# EAGLE design breakout (EAGLE 7.1.0)

## Sheet 1 of 2
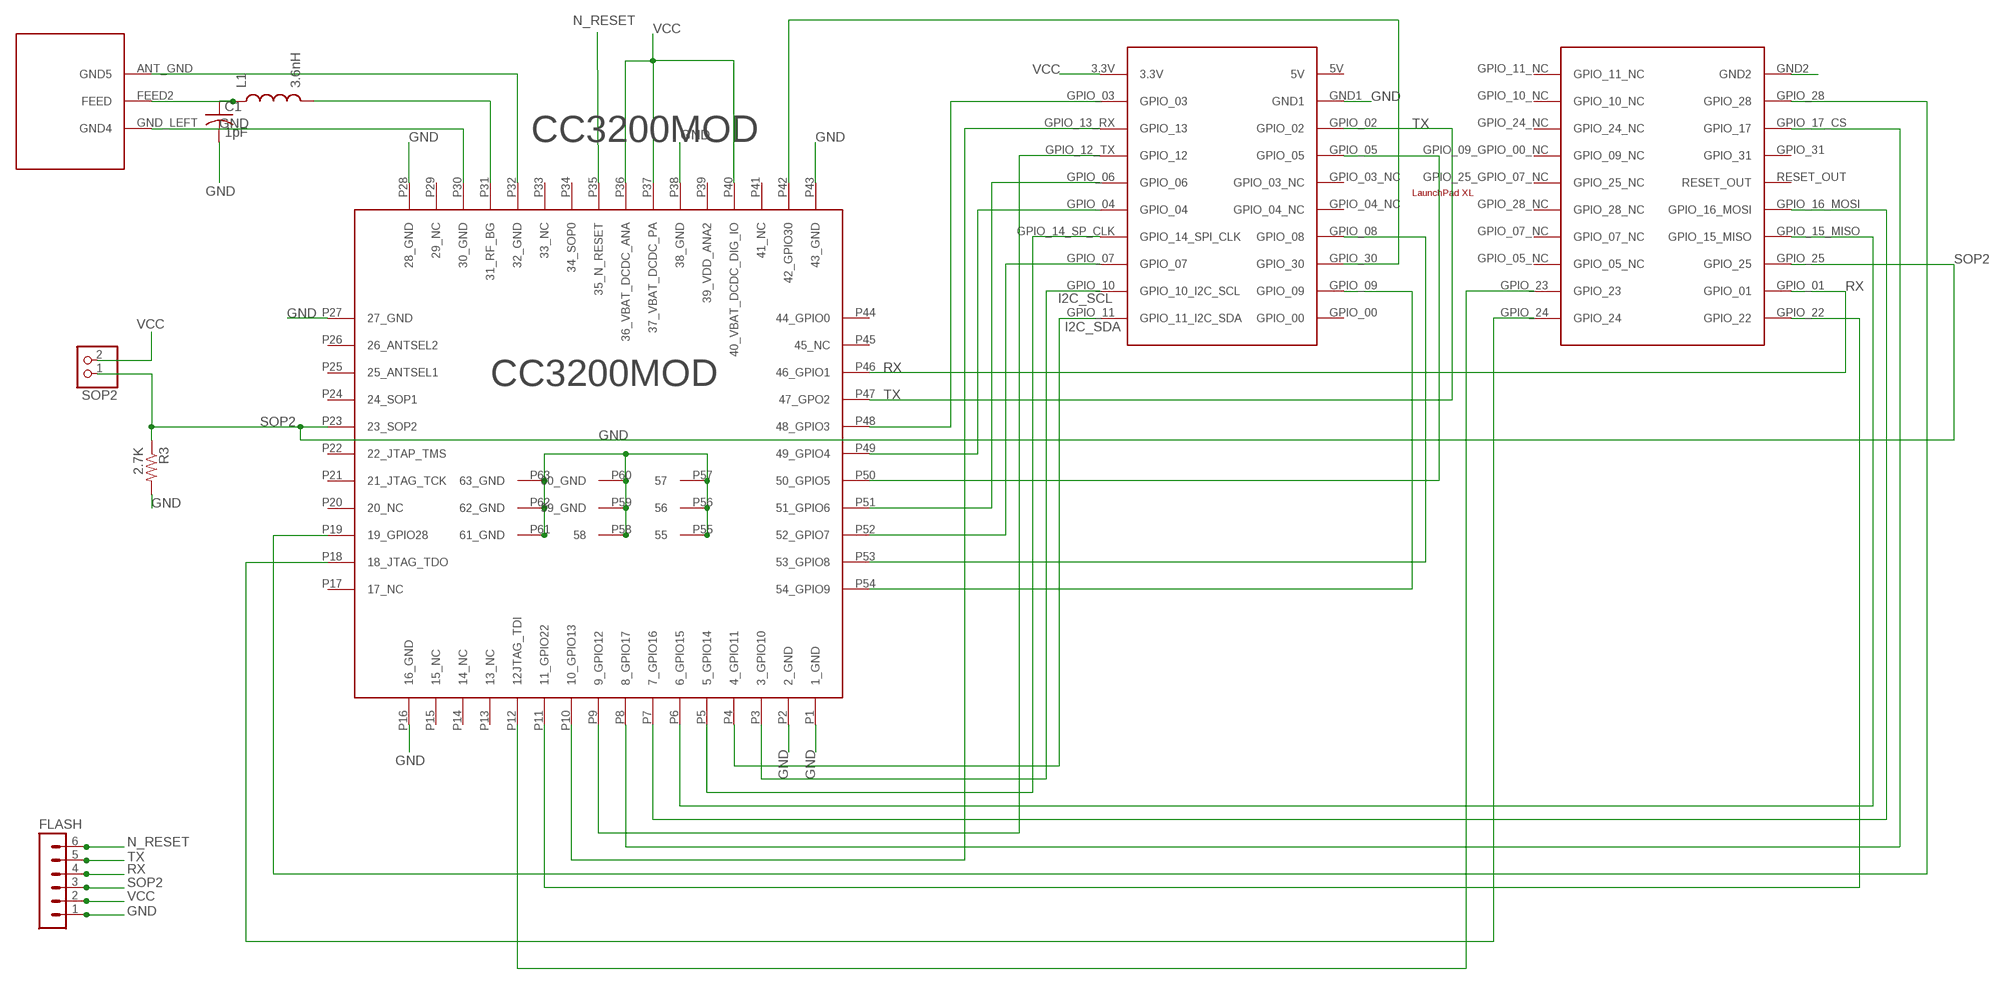
[diagram p0: schematic, sheet 1]

### Parts
ANT_PAD  ANT  [ANT]
C1  1pF  C-USC0402  [C0402]
CC3200MOD  CC3200  [CC3200MOD]
FLASH  MA06-1  [MA06-1]
L1  3.6nH  INDUCTOR-SPARKFUN0402  [C0402]
R3  2.7K  RESISTOR0603  [0603-RES]
SOP2  PINHD-1X2  [1X02]
U11  XL  [LAUNCHPADXL]

### Nets
GND: ANT_PAD.ANT_GND(GND5) ANT_PAD.GND_LEFT(GND4) C1.2 CC3200MOD.P1(1_GND) CC3200MOD.P2(2_GND) CC3200MOD.P16(16_GND) CC3200MOD.P27(27_GND) CC3200MOD.P28(28_GND) CC3200MOD.P30(30_GND) CC3200MOD.P32(32_GND) CC3200MOD.P38(38_GND) CC3200MOD.P43(43_GND) CC3200MOD.P55 CC3200MOD.P56 CC3200MOD.P57 CC3200MOD.P58 CC3200MOD.P59(59_GND) CC3200MOD.P60(60_GND) CC3200MOD.P61(61_GND) CC3200MOD.P62(62_GND) CC3200MOD.P63(63_GND) FLASH.1 R3.2 U11.GND1 U11.GND2 ; also sheet 2
GPIO_05: CC3200MOD.P50(50_GPIO5) U11.GPIO_05
GPIO_09: CC3200MOD.P54(54_GPIO9) U11.GPIO_09 ; also sheet 2
GPIO_22: CC3200MOD.P11(11_GPIO22) U11.GPIO_22
I2C_SCL: CC3200MOD.P3(3_GPIO10) U11.GPIO_10(GPIO_10_I2C_SCL) ; also sheet 2
I2C_SDA: CC3200MOD.P4(4_GPIO11) U11.GPIO_11(GPIO_11_I2C_SDA) ; also sheet 2
JTAG_TDI: CC3200MOD.P12(12JTAG_TDI) U11.GPIO_23
JTAG_TDO: CC3200MOD.P18(18_JTAG_TDO) U11.GPIO_24
N$2: ANT_PAD.FEED2(FEED) C1.1 L1.1
N$3: CC3200MOD.P31(31_RF_BG) L1.2
N$8: CC3200MOD.P6(6_GPIO15) U11.GPIO_15_MISO
N$10: CC3200MOD.P7(7_GPIO16) U11.GPIO_16_MOSI
N$11: CC3200MOD.P8(8_GPIO17) U11.GPIO_17_CS(GPIO_17)
N$12: CC3200MOD.P5(5_GPIO14) U11.GPIO_14_SP_CLK(GPIO_14_SPI_CLK)
N$13: CC3200MOD.P19(19_GPIO28) U11.GPIO_28
N$14: CC3200MOD.P42(42_GPIO30) U11.GPIO_30
N$18: CC3200MOD.P51(51_GPIO6) U11.GPIO_06
N$19: CC3200MOD.P49(49_GPIO4) U11.GPIO_04
N$21: CC3200MOD.P52(52_GPIO7) U11.GPIO_07
N$22: CC3200MOD.P53(53_GPIO8) U11.GPIO_08
N$24: CC3200MOD.P10(10_GPIO13) U11.GPIO_13_RX(GPIO_13)
N$25: CC3200MOD.P9(9_GPIO12) U11.GPIO_12_TX(GPIO_12)
N$27: CC3200MOD.P48(48_GPIO3) U11.GPIO_03
N_RESET: CC3200MOD.P35(35_N_RESET) FLASH.6
RX: CC3200MOD.P46(46_GPIO1) FLASH.4 U11.GPIO_01
SOP2: CC3200MOD.P23(23_SOP2) FLASH.3 R3.1 SOP2.1 U11.GPIO_25
TX: CC3200MOD.P47(47_GPO2) FLASH.5 U11.GPIO_02
VCC: CC3200MOD.P36(36_VBAT_DCDC_ANA) CC3200MOD.P37(37_VBAT_DCDC_PA) CC3200MOD.P40(40_VBAT_DCDC_DIG_IO) FLASH.2 SOP2.2 U11.3.3V ; also sheet 2
Unconnected: CC3200MOD.P13(13_NC) CC3200MOD.P14(14_NC) CC3200MOD.P15(15_NC) CC3200MOD.P17(17_NC) CC3200MOD.P20(20_NC) CC3200MOD.P21(21_JTAG_TCK) CC3200MOD.P22(22_JTAP_TMS) CC3200MOD.P24(24_SOP1) CC3200MOD.P25(25_ANTSEL1) CC3200MOD.P26(26_ANTSEL2) CC3200MOD.P29(29_NC) CC3200MOD.P33(33_NC) CC3200MOD.P34(34_SOP0) CC3200MOD.P39(39_VDD_ANA2) CC3200MOD.P41(41_NC) CC3200MOD.P44(44_GPIO0) CC3200MOD.P45(45_NC) U11.5V U11.GPIO_00 U11.GPIO_03_NC U11.GPIO_04_NC U11.GPIO_05_NC U11.GPIO_07_NC U11.GPIO_09_GPIO_00_NC(GPIO_09_NC) U11.GPIO_10_NC U11.GPIO_11_NC U11.GPIO_24_NC U11.GPIO_25_GPIO_07_NC(GPIO_25_NC) U11.GPIO_28_NC U11.GPIO_31 U11.RESET_OUT

## Sheet 2 of 2
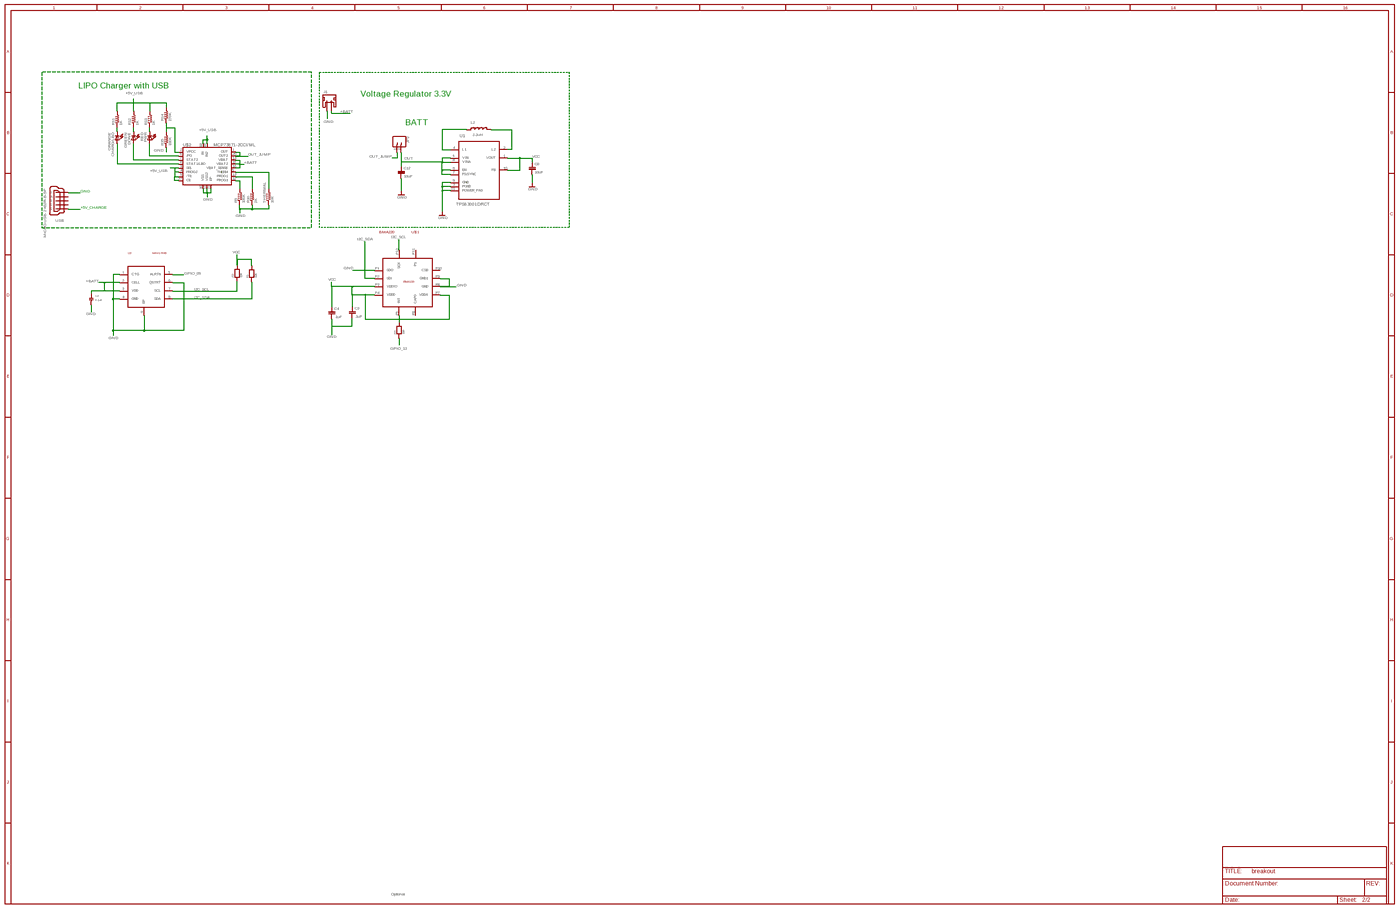
[diagram p1: schematic, sheet 2, overview]
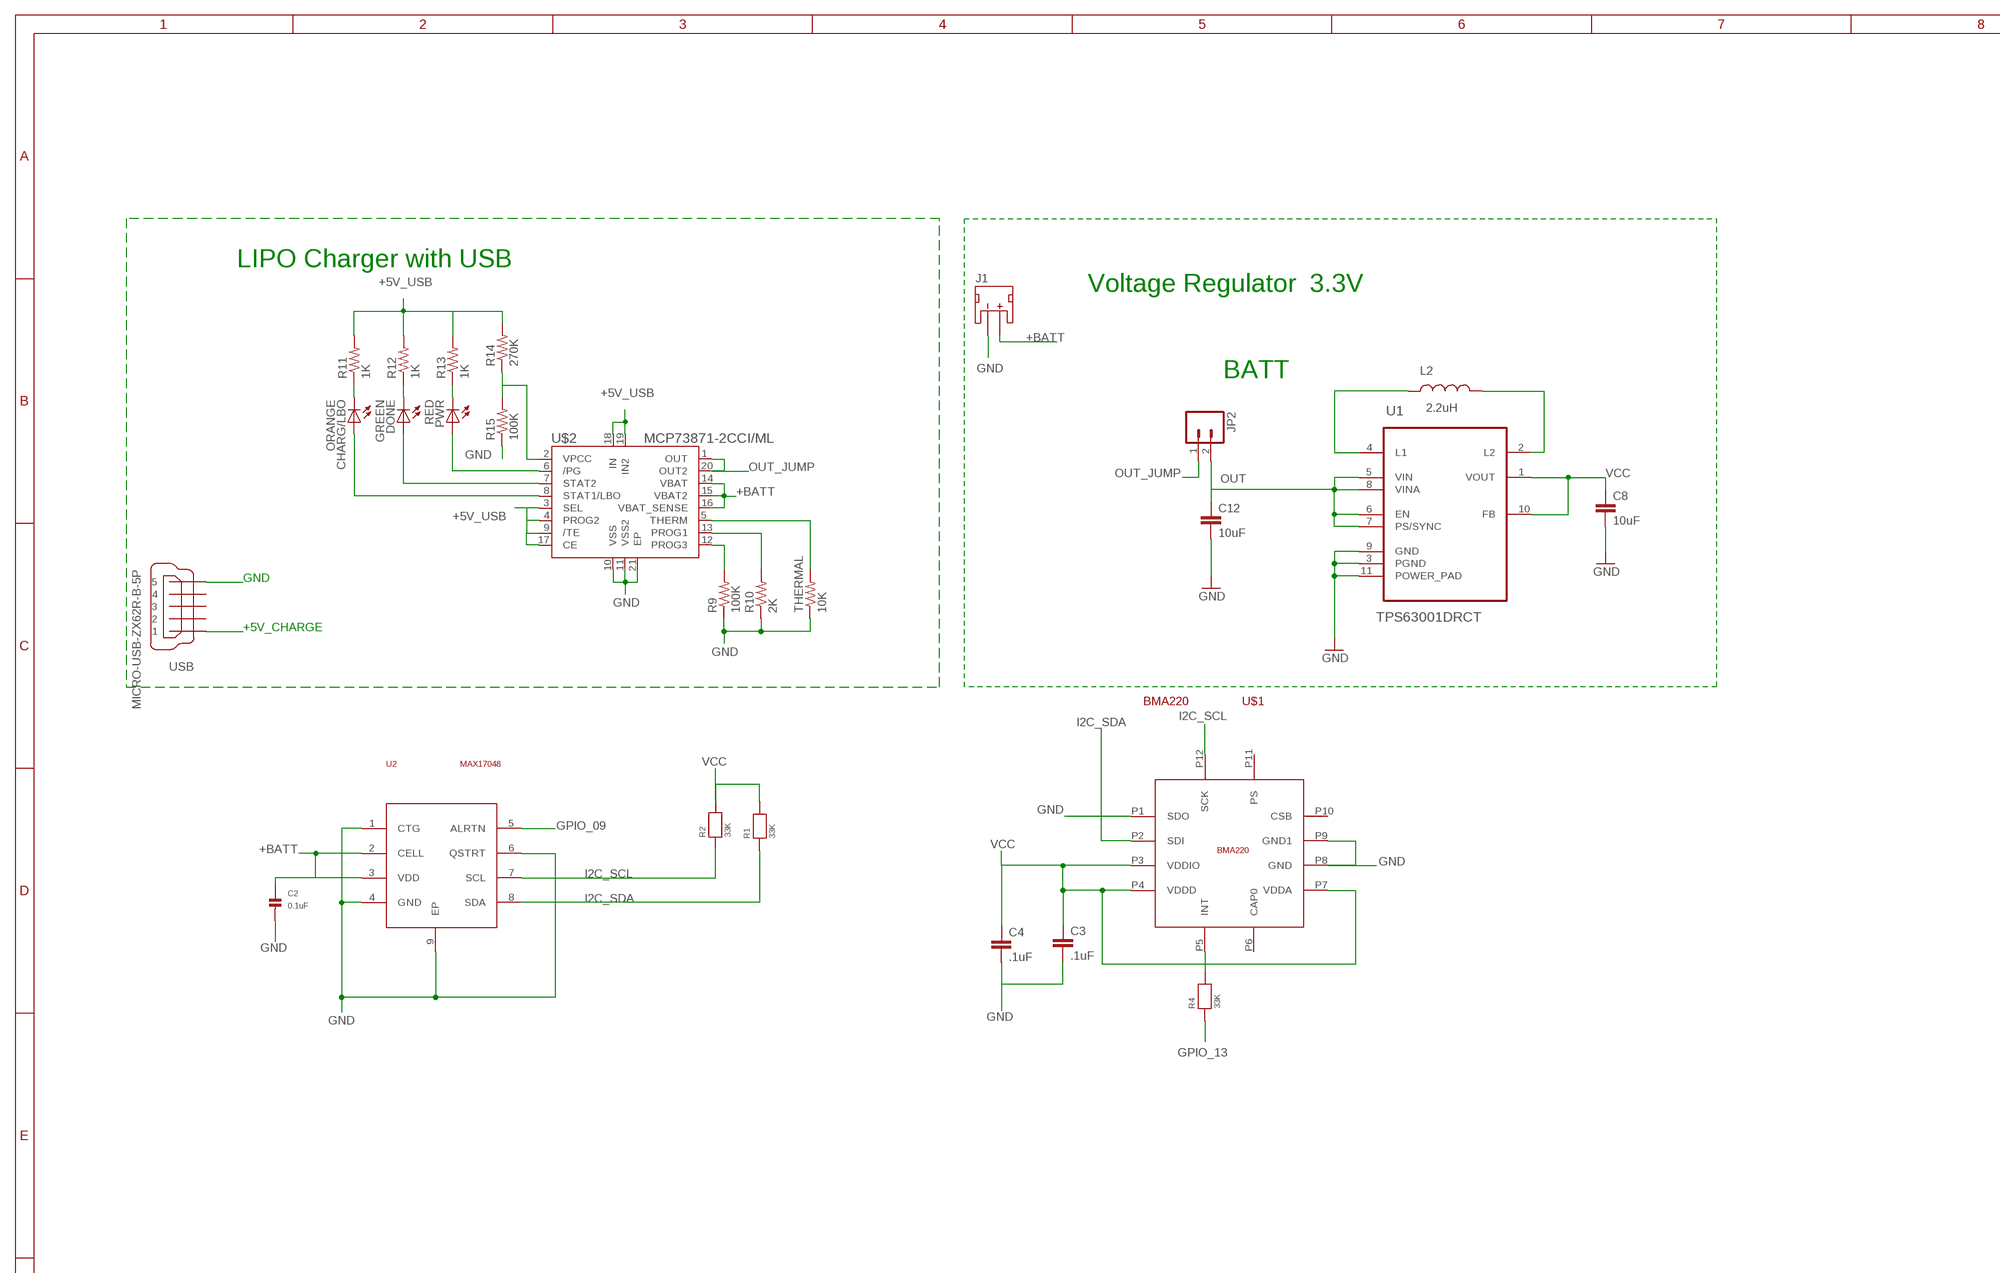
[diagram p2: schematic, sheet 2, part 1 of 4]
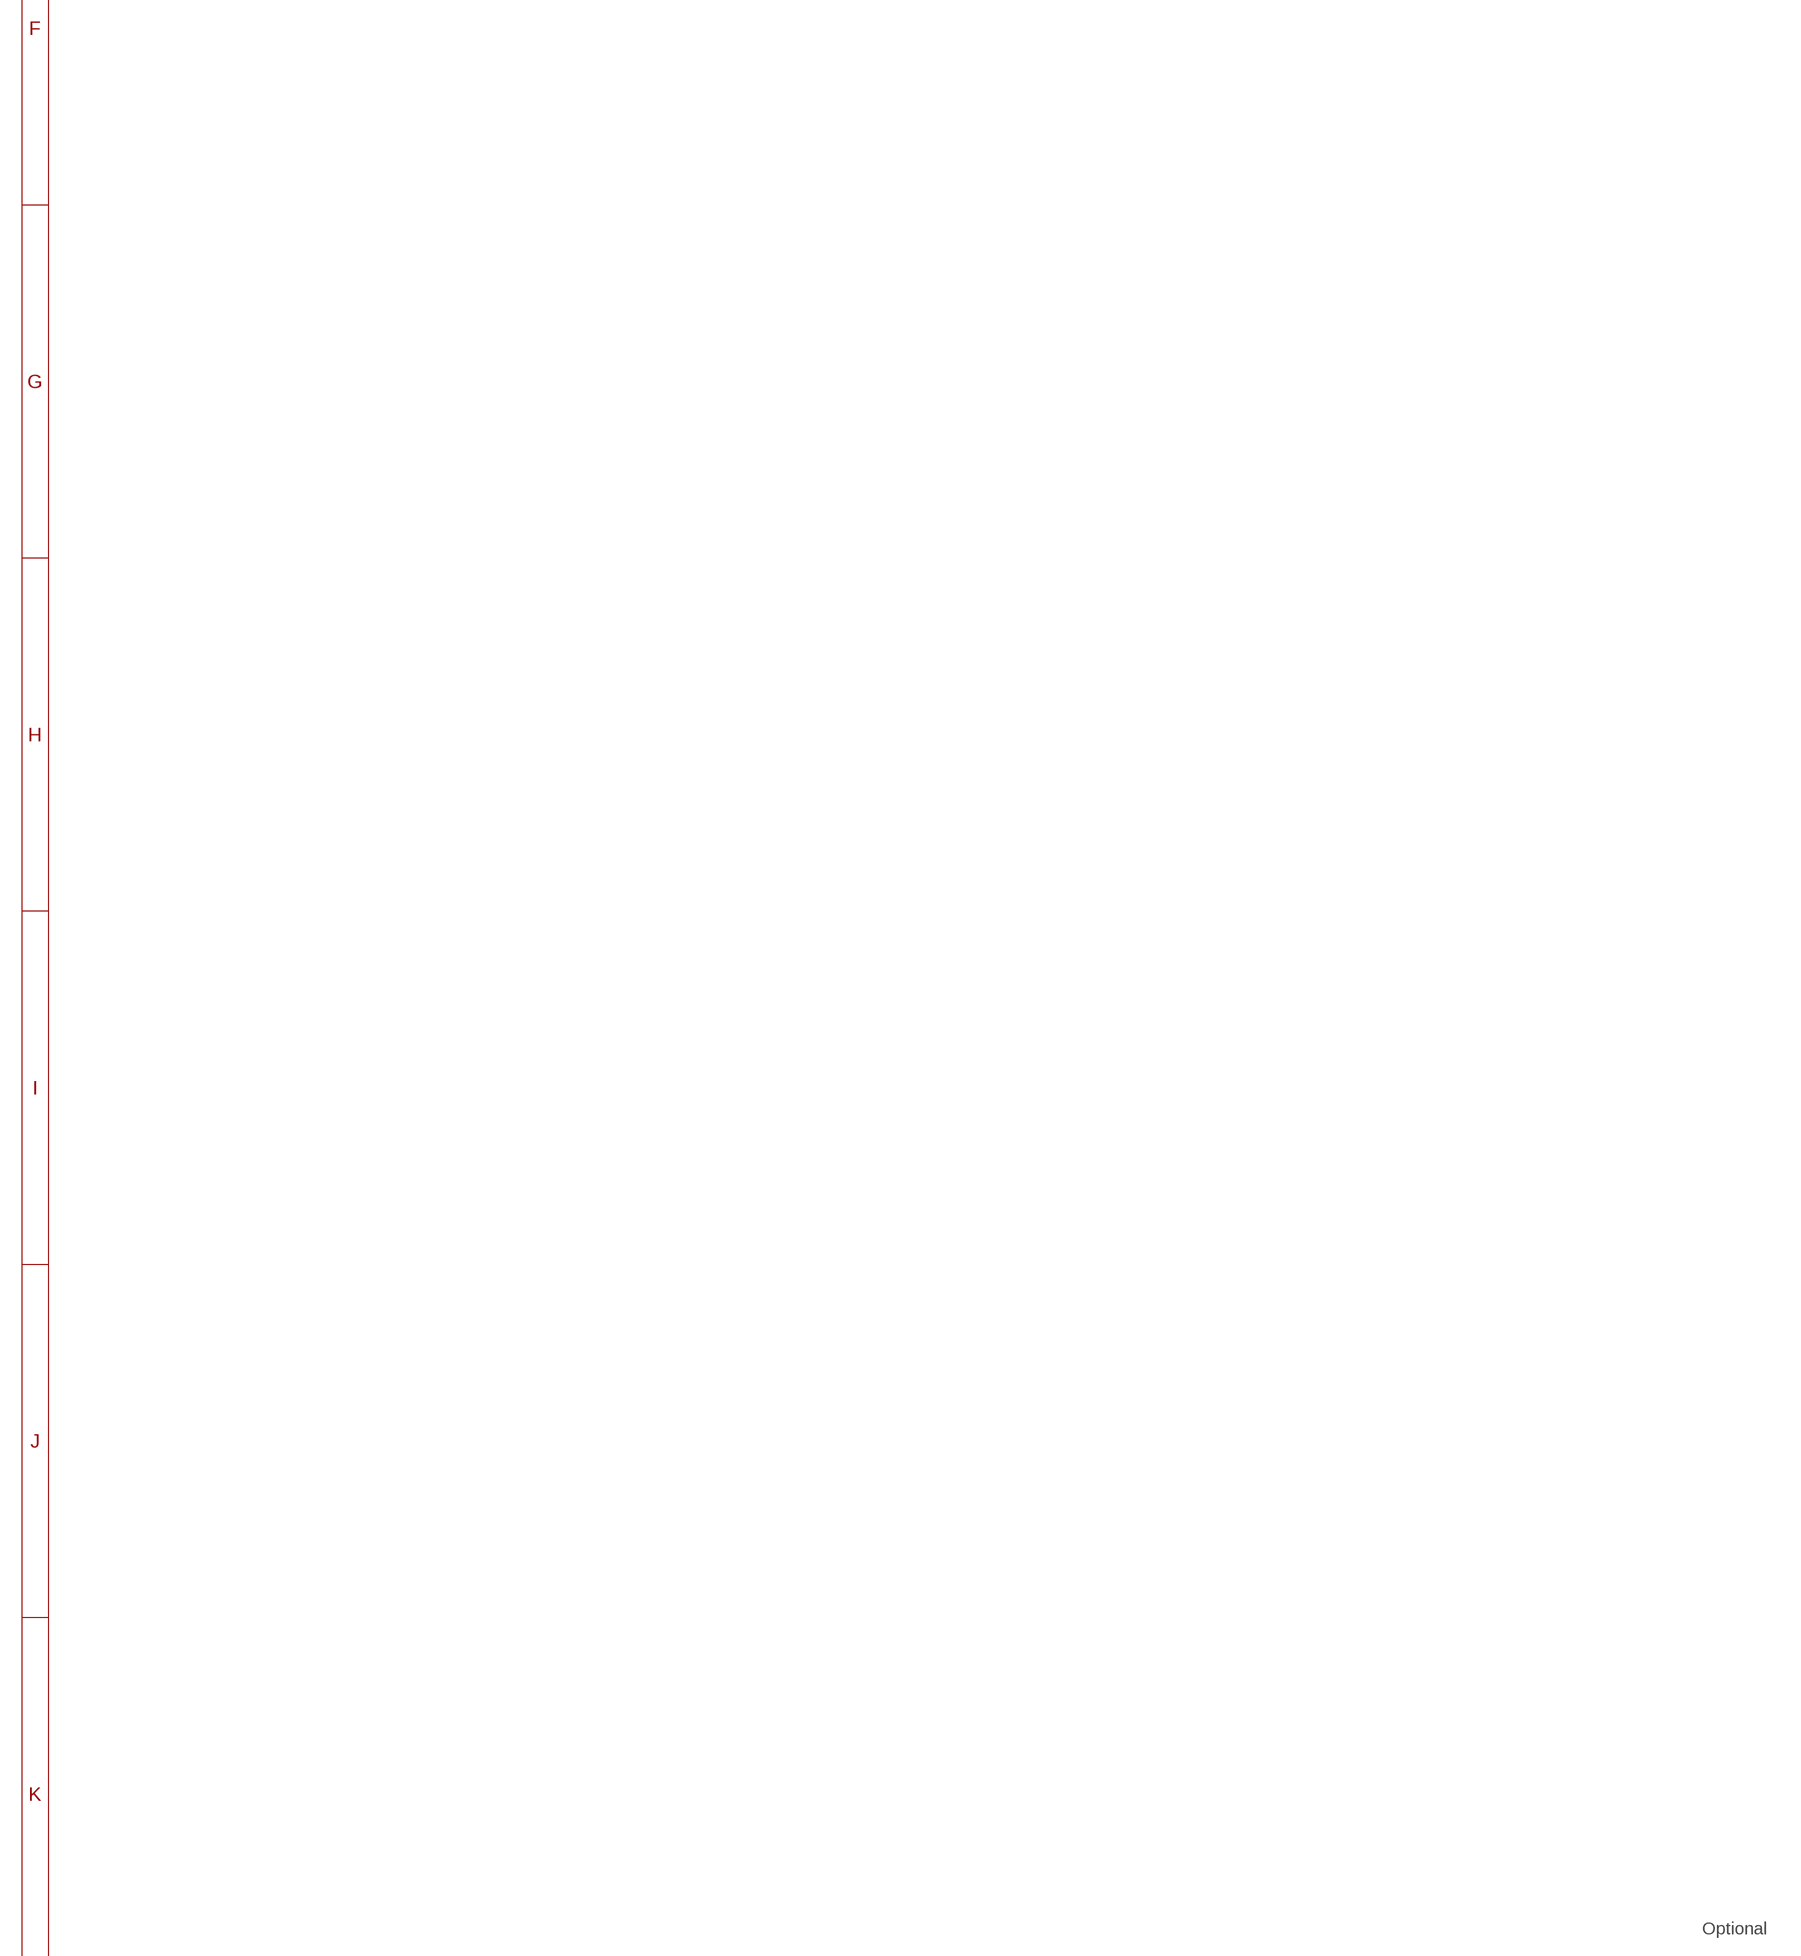
[diagram p3: schematic, sheet 2, part 2 of 4]
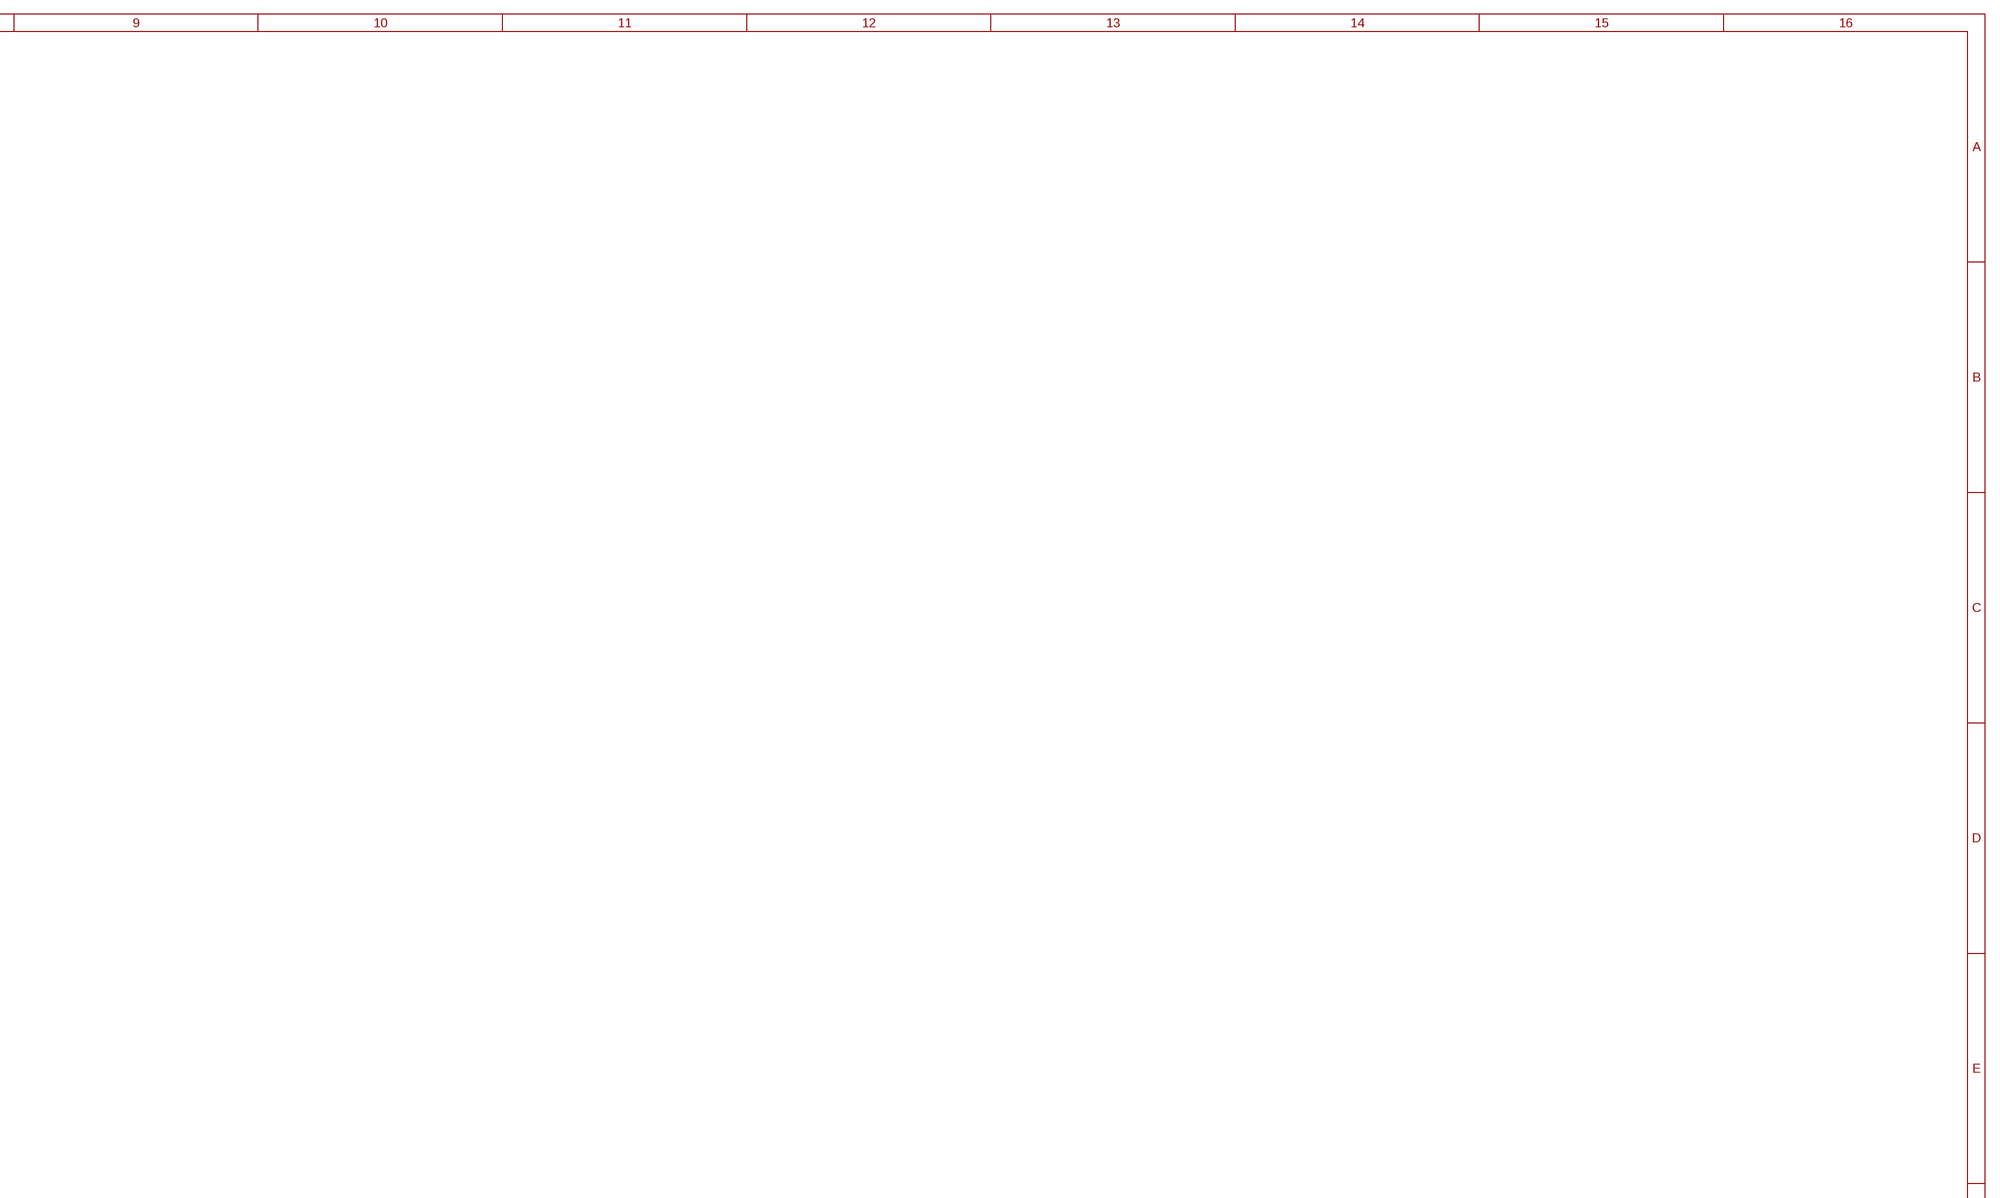
[diagram p4: schematic, sheet 2, part 3 of 4]
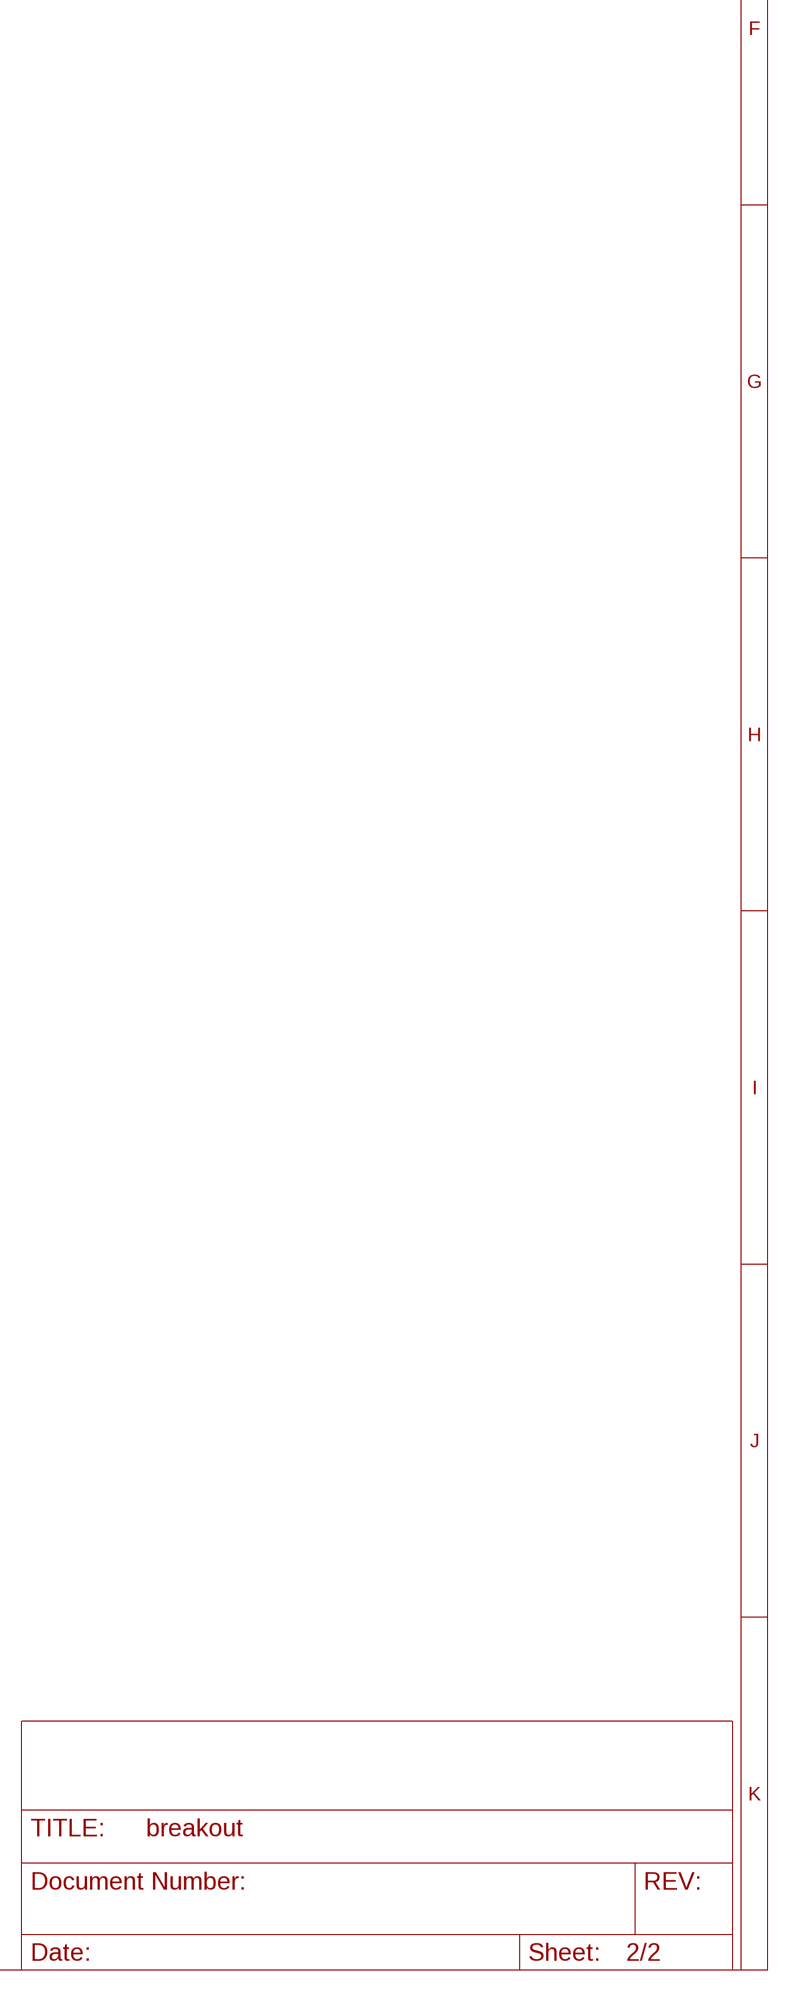
[diagram p5: schematic, sheet 2, part 4 of 4]

### Parts
C2  0.1uF  CAP_CERAMIC0402  [0402]
C3  .1uF  C-EUC0603  [C0603]
C4  .1uF  C-EUC0603  [C0603]
C8  10uF  C-EUC0603  [C0603]
C12  10uF  C-EUC0603  [C0603]
CHARG/LBO  ORANGE  LEDSML0603  [SML0603]
DONE  GREEN  LEDSML0603  [SML0603]
J1  JST_2MM_MALE  [JST-2-SMD]
JP2  M02PTH  [1X02]
L2  2.2uH  INDUCTOR0805  [0805]
PWR  RED  LEDSML0603  [SML0603]
R1  33K  RESISTOR0402  [0402]
R2  33K  RESISTOR0402  [0402]
R4  33K  RESISTOR0402  [0402]
R9  100K  RESISTOR0603-RES  [0603-RES]
R10  2K  RESISTOR0603-RES  [0603-RES]
R11  1K  RESISTOR0603-RES  [0603-RES]
R12  1K  RESISTOR0603-RES  [0603-RES]
R13  1K  RESISTOR0603-RES  [0603-RES]
R14  270K  RESISTOR0603-RES  [0603-RES]
R15  100K  RESISTOR0603-RES  [0603-RES]
THERMAL  10K  RESISTOR0603-RES  [0603-RES]
U1  TPS63001DRCT  [SON50P300X300X100-11N]
U2  MAX17048  [DFN200X200X80-9N]
U$1  BMA220  [BMA222]
U$2  MCP73871-2CCI/ML  [QFN20-4X4]
USB  MICRO-USB-ZX62R-B-5P  [ZX62R-B-5P]

### Nets
+5V_USB: R11.2 R12.2 R13.2 R14.2 U$2.3(SEL) U$2.4(PROG2) U$2.9(/TE) U$2.17(CE) U$2.18(IN) U$2.19(IN2) USB.1
+BATT: C2.1 J1.2(+) U2.2(CELL) U2.3(VDD) U$2.14(VBAT) U$2.15(VBAT2) U$2.16(VBAT_SENSE)
GND: C2.2 C3.2 C4.2 C8.2 C12.2 J1.1(-) R9.1 R10.1 R15.1 THERMAL.1 U1.3(PGND) U1.9(GND) U1.11(POWER_PAD) U2.1(CTG) U2.4(GND) U2.6(QSTRT) U2.9(EP) U$1.P1(SDO) U$1.P8(GND) U$1.P9(GND1) U$2.10(VSS) U$2.11(VSS2) U$2.21(EP) USB.5 ; also sheet 1
GPIO_09: U2.5(ALRTN) ; also sheet 1
GPIO_13: R4.1
I2C_SCL: R2.1 U2.7(SCL) U$1.P12(SCK) ; also sheet 1
I2C_SDA: R1.1 U2.8(SDA) U$1.P2(SDI) ; also sheet 1
N$7: R4.2 U$1.P5(INT)
N$17: R9.2 U$2.12(PROG3)
N$20: R10.2 U$2.13(PROG1)
N$26: PWR.A U$2.6(/PG)
N$28: THERMAL.2 U$2.5(THERM)
N$29: L2.1 U1.4(L1)
N$30: L2.2 U1.2(L2)
N$31: DONE.A U$2.7(STAT2)
N$32: CHARG/LBO.A U$2.8(STAT1/LBO)
N$33: CHARG/LBO.C R11.1
N$35: DONE.C R12.1
N$36: PWR.C R13.1
N$37: R14.1 R15.2 U$2.2(VPCC)
OUT: C12.1 JP2.2 U1.5(VIN) U1.6(EN) U1.7(PS/SYNC) U1.8(VINA)
OUT_JUMP: JP2.1 U$2.1(OUT) U$2.20(OUT2)
VCC: C3.1 C4.1 C8.1 R1.2 R2.2 U1.1(VOUT) U1.10(FB) U$1.P3(VDDIO) U$1.P4(VDDD) U$1.P7(VDDA) ; also sheet 1
Unconnected: J1.NC1(PAD1) J1.NC2(PAD2) U$1.P6(CAP0) U$1.P10(CSB) U$1.P11(PS) USB.2 USB.3 USB.4

### Notes on the sheet
- LIPO Charger with USB
- Voltage Regulator | 3.3V
- BATT
- GND
- +5V_CHARGE
- Optional

## Library data of the parts
ANT_PAD = Antenna:ANT
C1 = rcl:C-US: CAPACITOR, American symbol
C2 = microbuilder:CAP_CERAMIC: Ceramic Capacitors 0402 - 0402 Surface Mount Capacitors 16pF 50V 5% [Digikey: 445-4899-2-ND] 18pF 50V 5% [Digikey: 490-1281-2-ND] 22pF 50V 5% [Digikey: 490-1283-2-ND] 68pF 50V 5% [Digikey: 490-1289-2-ND] 0.1uF 10V 10% [Digikey: 490-1318-2-ND] 1.0uF 6.3V 10% [Digikey: 490-1320-2-ND] 0603 - 0603 Surface Mount Capacitors 16 pF 50V 5% [Digikey: 445-5051-2-ND] 22 pF 50V [Digikey: PCC220ACVTR-ND] 33 pF 50V 5% [Digikey: 490-1415-1-ND] 56pF 50V 5% [Digikey: 490-1421-1-ND] 220pF 50V 5% [Digikey: 445-1285-1-ND] 680 pF 50V 2200 pF 50V 5% C0G [Digikey: 445-1297-1-ND] 5600 pF 100V 5% X7R [Digikey: 478-3711-1-ND] 0.1 µF 25V 10% [Digikey: PCC2277TR-ND] 0.22 µF 16V 10% X7R [Digikey: 445-1318-1-ND] 1.0 µF 25V 10% [Digikey: 445-5146-2-ND] 0603 - RF Specific 3pF 250V +/-0.1pF RF [Digikey: 712-1347-1-ND] 18 pF 250V 5% [Digikey: 478-3505-1-ND or 712-1322-1-ND] 56 pF 250V 5% C0G RF [Digikey: 490-4867-1-ND] 68 pF 250V RF [Digikey: 490-4868-1-ND] 0805 - 0805 Surface Mount Capacitors 220 pF 250V 2% RF Ceramic Capacitor [Digikey: 712-1398-1-ND] 1000 pF 50V 2% NP0 Ceramic Capacitor [Digikey: 478-3760-1-ND] 0.1 µF 25V 10% Ceramic Capacitor [Digikey: PCC1828TR-ND] 1.0 µF 16V 10% Ceramic Capacitor[Digikey: 490-1691-2-ND] 10.0 µF 10V 10% Ceramic Capacitor[Digikey: 709-1228-1-ND] 10.0 uF 16V 10% Ceramic Capacitor [Digikey: 478-5165-2-ND] 47 uF 6.3V 20% Ceramic Capacitor [Digikey: 587-1779-1-ND or 399-5506-1-ND] 1206 - 1206 Surface Mount Capacitors 47uF 10V 20% Ceramic Capacitor [Digikey: 490-5528-1-ND or 399-5508-1-ND or 445-6010-1-ND] 100uF 6.3V -20%, +80% Y5V Ceramic Capacitor (Digikey: 490-4512-1-ND, Mouser: 81-GRM31CF50J107ZE1L)
C3 C4 C8 C12 = rcl:C-EU: CAPACITOR, European symbol
CC3200MOD = cc3200mod:CC3200
CHARG/LBO DONE PWR = led:LED: LED OSRAM: - CHIPLED LG R971, LG N971, LY N971, LG Q971, LY Q971, LO R971, LY R971 LH N974, LH R974 LS Q976, LO Q976, LY Q976 LO Q996 - Hyper CHIPLED LW Q18S LB Q993, LB Q99A, LB R99A - SideLED LS A670, LO A670, LY A670, LG A670, LP A670 LB A673, LV A673, LT A673, LW A673 LH A674 LY A675 LS A676, LA A676, LO A676, LY A676, LW A676 LS A679, LY A679, LG A679 - Hyper Micro SIDELED® LS Y876, LA Y876, LO Y876, LY Y876 LT Y87S - SmartLED LW L88C, LW L88S LB L89C, LB L89S, LG L890 LS L89K, LO L89K, LY L89K LS L896, LA L896, LO L896, LY L896 - TOPLED LS T670, LO T670, LY T670, LG T670, LP T670 LSG T670, LSP T670, LSY T670, LOP T670, LYG T670 LG T671, LOG T671, LSG T671 LB T673, LV T673, LT T673, LW T673 LH T674 LS T676, LA T676, LO T676, LY T676, LB T676, LH T676, LSB T676, LW T676 LB T67C, LV T67C, LT T67C, LS T67K, LO T67K, LY T67K, LW E67C LS E67B, LA E67B, LO E67B, LY E67B, LB E67C, LV E67C, LT E67C LW T67C LS T679, LY T679, LG T679 LS T770, LO T770, LY T770, LG T770, LP T770 LB T773, LV T773, LT T773, LW T773 LH T774 LS E675, LA E675, LY E675, LS T675 LS T776, LA T776, LO T776, LY T776, LB T776 LHGB T686 LT T68C, LB T68C - Hyper Mini TOPLED® LB M676 - Mini TOPLED Santana® LG M470 LS M47K, LO M47K, LY M47K Source: http://www.osram.convergy.de LUXEON: - LUMILED® LXK2-PW12-R00, LXK2-PW12-S00, LXK2-PW14-U00, LXK2-PW14-V00 LXK2-PM12-R00, LXK2-PM12-S00, LXK2-PM14-U00 LXK2-PE12-Q00, LXK2-PE12-R00, LXK2-PE12-S00, LXK2-PE14-T00, LXK2-PE14-U00 LXK2-PB12-K00, LXK2-PB12-L00, LXK2-PB12-M00, LXK2-PB14-N00, LXK2-PB14-P00, LXK2-PB14-Q00 LXK2-PR12-L00, LXK2-PR12-M00, LXK2-PR14-Q00, LXK2-PR14-R00 LXK2-PD12-Q00, LXK2-PD12-R00, LXK2-PD12-S00 LXK2-PH12-R00, LXK2-PH12-S00 LXK2-PL12-P00, LXK2-PL12-Q00, LXK2-PL12-R00 Source: www.luxeon.com KINGBRIGHT: KA-3528ASYC Source: www.kingbright.com
FLASH = con-lstb:MA06-1: PIN HEADER; OC_FARNELL: unknown; OC_NEWARK: unknown
J1 = SparkFun-Connectors:JST_2MM_MALE: Mates to single-cell LiPo batteries. CONN-08352; PROD_ID: CONN-08352
JP2 = DECADE-libraries:M02: Header 2 Standard 2-pin 0.1" header. Use with straight break away headers (SKU : PRT-00116), right angle break away headers (PRT-00553), swiss pins (PRT-00743), machine pins (PRT-00117), and female headers (PRT-00115). Molex polarized connector foot print use with SKU : PRT-08233 with associated crimp pins and housings.
L1 = Spark:INDUCTOR-SPARKFUN: Inductors Basic Inductor/Choke - 0603 and 1206. Footprints are not proven and vary greatly between part numbers. SRN6045- 33uH, 20% 1.4A
L2 = SparkFun-Passives:INDUCTOR: Inductors Basic Inductor/Choke - 0603 and 1206. Footprints are not proven and vary greatly between part numbers. SRN6045- 33uH, 20% 1.4A SDR0403-560KL - 56uH, 10%, 500mA RMS/740mA peak
R1 R2 R4 = microbuilder:RESISTOR: Resistors 0402 - 0402 Surface Mount Package 22 Ohm 1% 1/16W [Digikey: 311-22.0LRTR-ND] 33 Ohm 5% 1/16W 1.0K 5% 1/16W 1.5K 5% 1/16W 2.0K 1% 1/16W 10.0K 1% 1/16W [Digikey: 311-10.0KLRTR-ND] 10.0K 5% 1/16W [Digikey: RMCF0402JT10K0TR-ND] 12.1K 1% 1/16W [Digikey: 311-22.0LRTR-ND] 100.0K 5% 1/16W 0603 - 0603 Surface Mount Package 0 Ohm 1/10 Watt 1% Resistor 15 Ohm 1/10 Watt 1% Resistor 33 Ohm 1/10 Watt 1% Resistor 49.9 Ohm 1/10 Watt 1% Resistor 100 Ohm 1/10 Watt 1% Resistor 150 Ohm 1/10 Watt 1% Resistor 240 Ohm 1/10 Watt 1% Resistor 390 Ohm 1/10 Watt 1% Resistor 560 Ohm 1/10 Watt 1% Resistor 680 Ohm 1/10 Watt 1% Resistor 750 Ohm 1/10 Watt 1% Resistor 1.0K Ohm 1/10 Watt 1% Resistor 1.5K Ohm 1/10 Watt 1% Resistor 2.0K Ohm 1/10 Watt 1% Resistor 2.2K Ohm 1/10 Watt 1% Resistor 3.3K Ohm 1/10 Watt 1% Resistor 4.7K Ohm 1/10 Watt 1% Resistor 10.0K Ohm 1/10 Watt 1% Resistor 12.0K Ohm 1/10 Watt 1% Resistor 12.1K Ohm 1/10 Watt 1% Resistor 20.0K Ohm 1/10 Watt 1% Resistor 33.0K Ohm 1/10 Watt 1% Resistor 100.0K Ohm 1/10 Watt 1% Resistor 0805 - 0805 Surface Mount Package 0 Ohm 1/8 Watt 1% Resistor 33 Ohm 1/8 Watt 1% Resistor 100 Ohm 1/8 Watt 1% Resistor 150 Ohm 1/8 Watt 1% Resistor 200 Ohm 1/8 Watt 1% Resistor 240 Ohm 1/8 Watt 1% Resistor 330 Ohm 1/8 Watt 1% Resistor 390 Ohm 1/8 Watt 1% Resistor 470 Ohm 1/8 Watt 1% Resistor 1.0K Ohm 1/8 Watt 1% Resistor 1.5K Ohm 1/8 Watt 1% Resistor 2.0K Ohm 1/8 Watt 1% Resistor 4.7K Ohm 1/8 Watt 1% Resistor 5.1K Ohm 1/8 Watt 1% Resistor 5.6K Ohm 1/8 Watt 1% Resistor 10.0K Ohm 1/8 Watt 1% Resistor 22.0K Ohm 1/8 Watt 1% Resistor 33.0K Ohm 1/8 Watt 1% Resistor 100K Ohm 1/8 Watt 1% Resistor 1206 - 1206 Surface Mount Package 2012 - 2010 Surface Mount Package 0.11 Ohm 1/2 Watt 1% Resistor - Digikey: RHM.11UCT-ND
R3 = SparkFun-Resistors:RESISTOR: Resistor Basic schematic elements and footprints for 0603, 1206, and PTH resistors.
R9-R15 THERMAL = SparkFun-Passives:RESISTOR: Resistor Basic schematic elements and footprints for 0603, 1206, and PTH resistors.
SOP2 = pinhead:PINHD-1X2: PIN HEADER
U1 = TPS63001:TPS63001DRCT: HIGH EFFICIENT SINGLE INDUCTOR BUCK-BOOST CONVERTER WITH 1.8-A SWITCHES; MPN: TPS63001DRCT; OC_FARNELL: 1652399; OC_NEWARK: 22M1824; PACKAGE: SON-10; SUPPLIER: TEXAS INSTRUMENTS
U2 = Maxim_By_element14_Batch_1:MAX17048
U11 = LaunchPadXL:XL
U$1 = bma220:BMA220: The BMA220 is an ultra small triaxial, low-g acceleration sensor with digital interfaces, aiming for low-power consumer market applications.
U$2 = microchip-battery:MCP73871: Stand-Alone System Load Sharing and Li-Ion / Li-Polymer Battery Charge Managemen The MCP73871 device is a 1A fully integrated linear solution for system load sharing and Li-Ion / Li-Polymer battery charge management with AC-DC wall adapter and USB port power sources selection. It?s also capable of autonomous power source selection between input or battery. The MCP73871 device employs a constant current/constant voltage (CC/CV) charge algorithm with selectable charge termination point. The constant voltage regulation is fixed with four available options: 4.10V, 4.20V, 4.35V, or 4.40V.; LBO: 3.1 V; SAFETYTIMER: 6 Hours; VREG: 4.20V
USB = con-hirose:MICRO-USB-: Hirose Micro USB Connector ZX62R-B-5P: Micro B, reverse (top mount) shell SMT Supplier: DigiKey H11574CT-ND Source: http://www.hirose.co.jp/cataloge_hp/e24200011.pdf

## Board
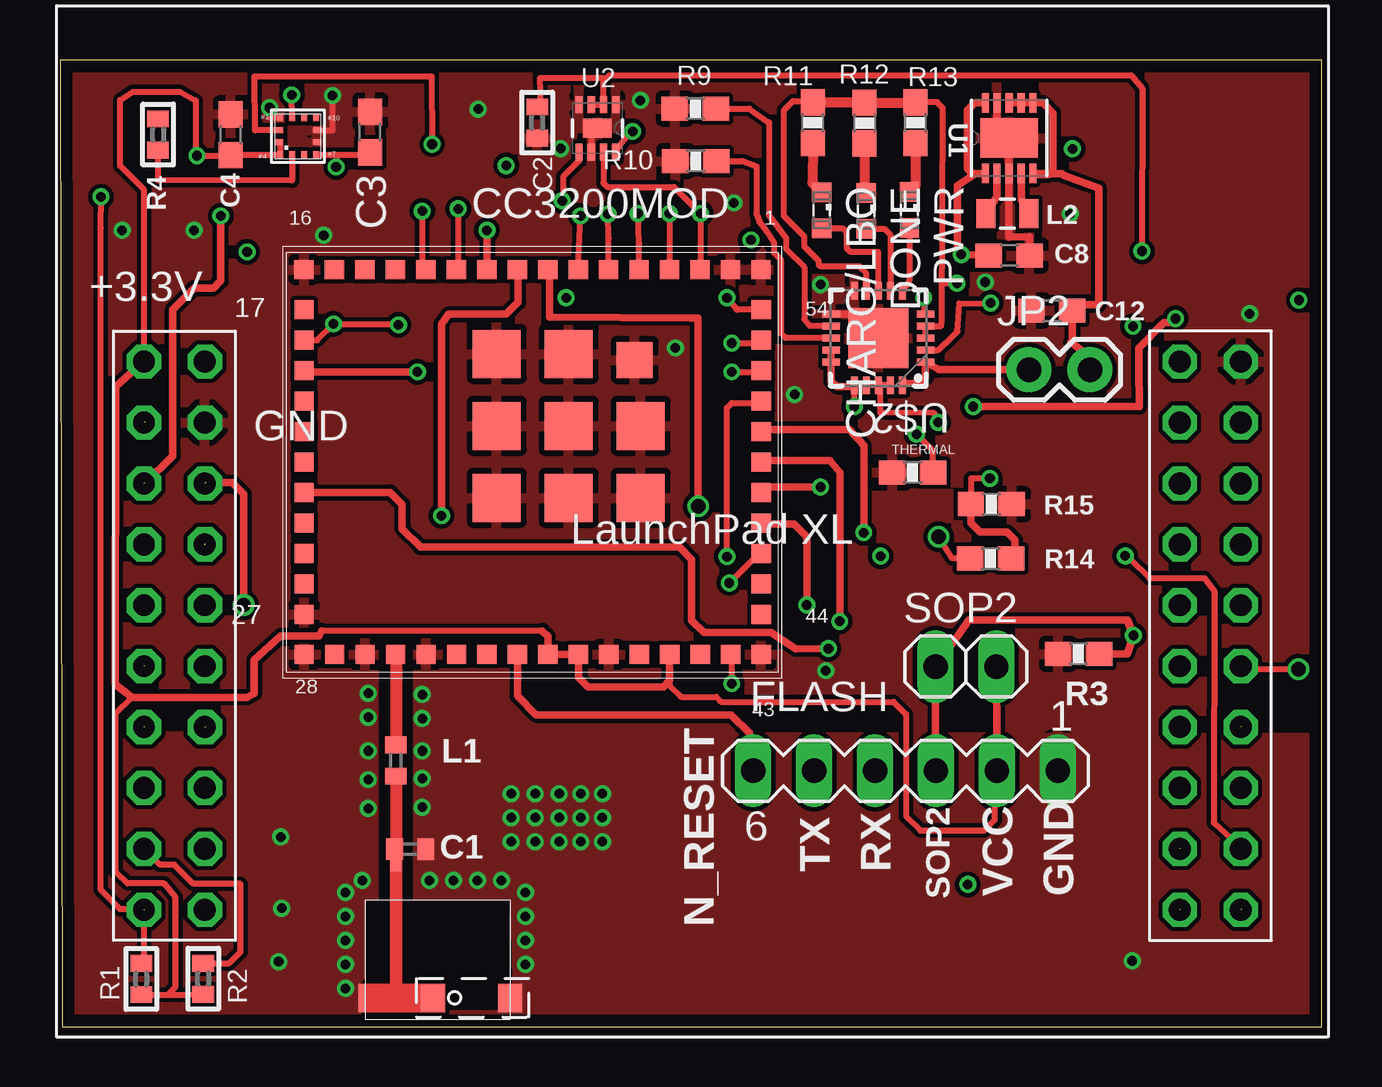
[diagram p6: board, top side]
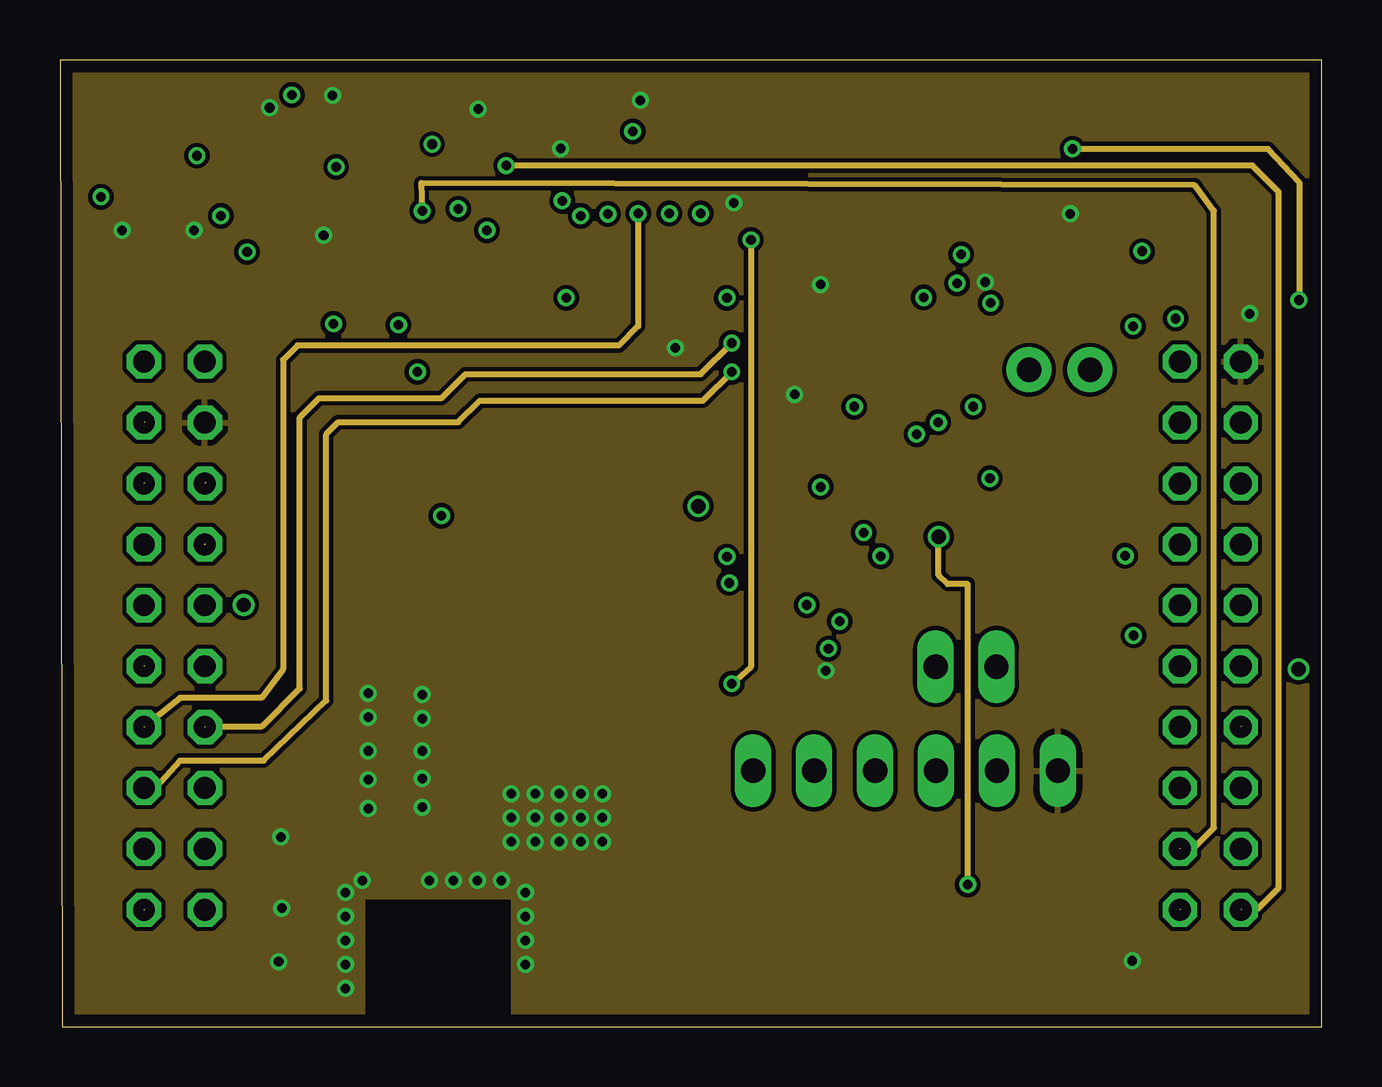
[diagram p7: board, inner layer Route2]
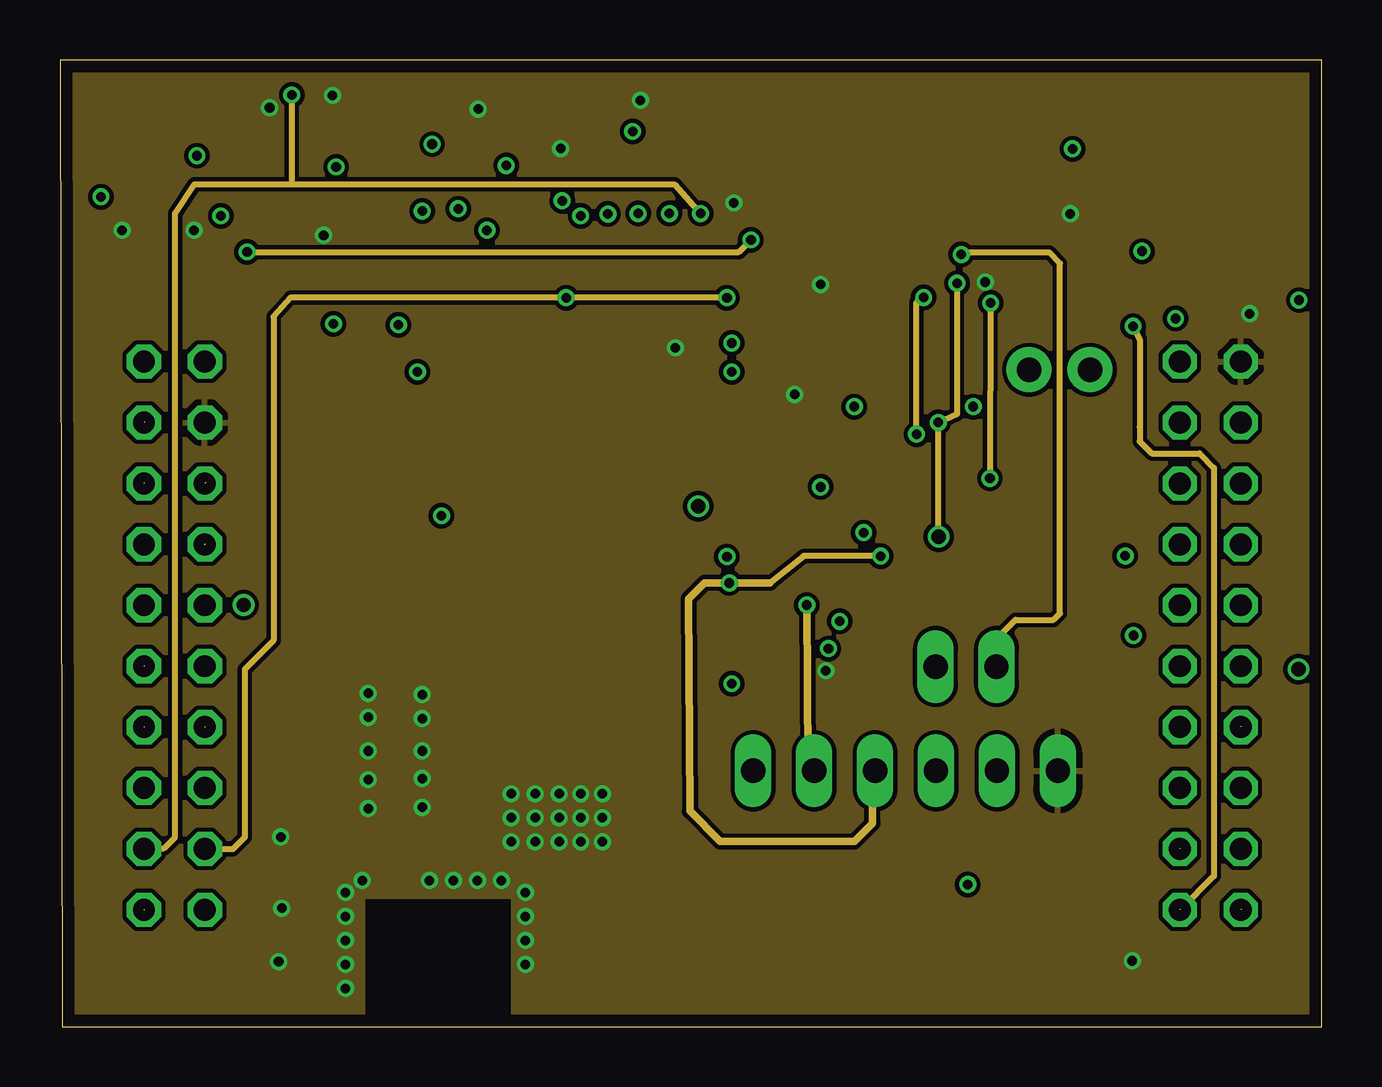
[diagram p8: board, inner layer Route15]
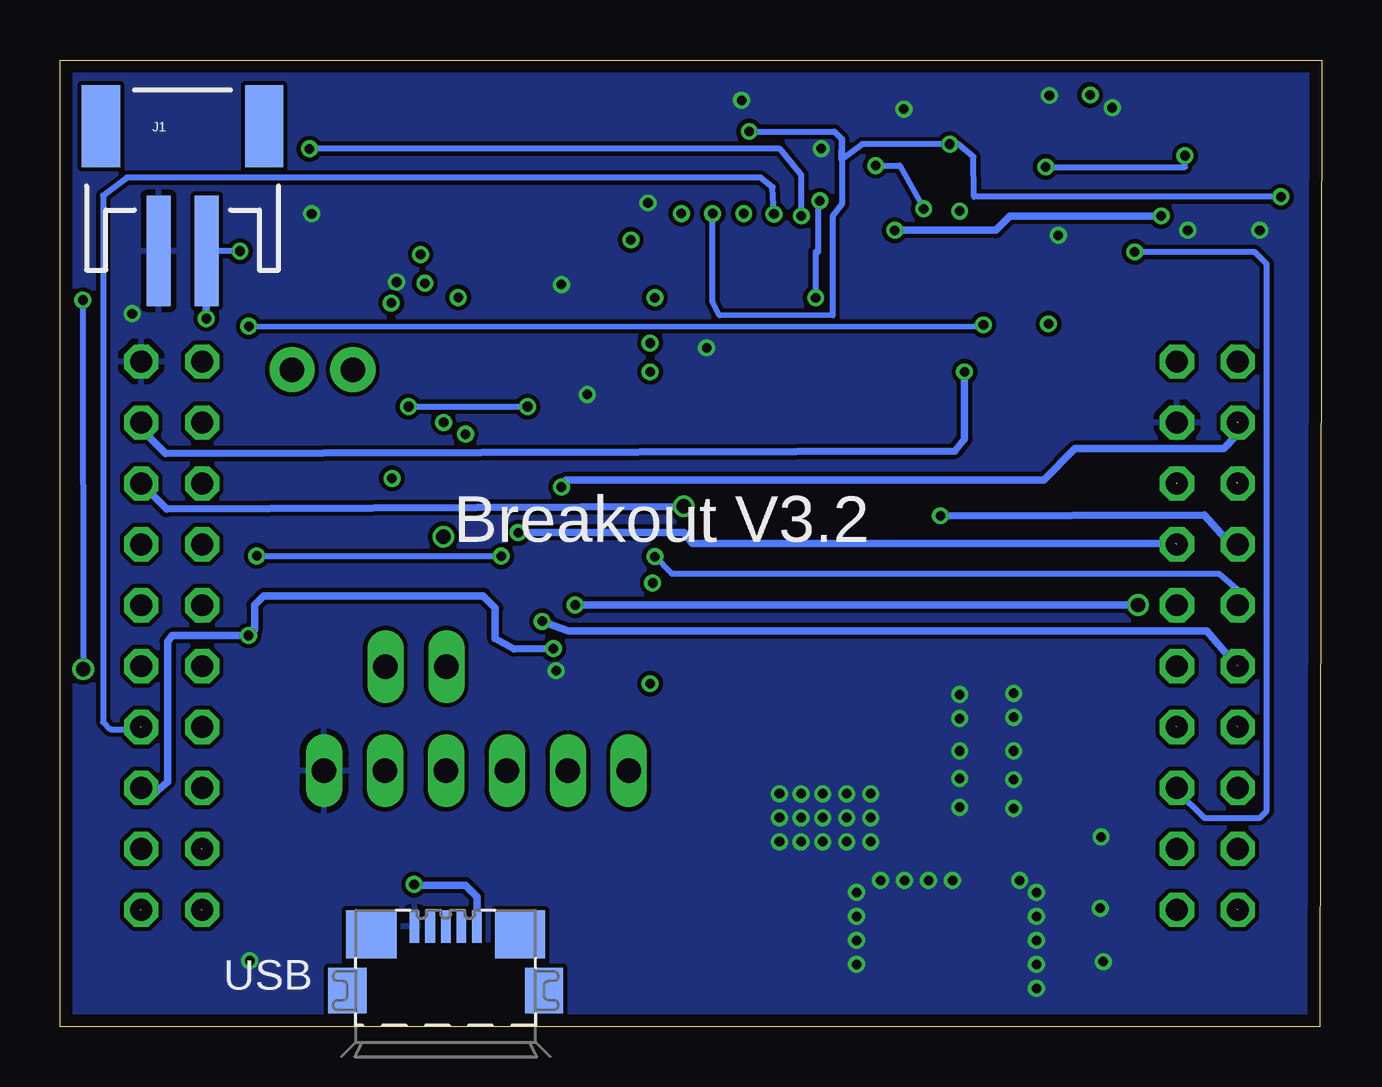
[diagram p9: board, bottom side, seen from below]

Size 52.6 x 40.3 mm. Coordinates in mm from the lower left corner, seen from the top.
Outline: 0.1,0 52.6,0 52.6,40.3 0,40.3 0.1,0
Copper layers (1*2*15*16): Top 0.035mm / dielectric 10mil / Route2 0.035mm / dielectric 10mil / Route15 0.035mm / dielectric 10mil / Bottom 0.035mm
Design rules "EagleRules *": minimum track width 7mil, minimum drill 12mil, track to track 7mil, track to pad 7mil, pad to pad 7mil, via to via 7mil, smd to smd 0mil, copper to edge 20mil, drill to drill 10mil, minimum pad ring 10mil, minimum via ring 6mil, stop-mask expansion 2mil, vias tented up to drill 25mil, thermal gap 10mil

### Footprints (pad centres in the part's own frame; a part is rotated, then mirrored left to right if it is on the bottom)
ANT = smd 1 x 1.2: ANT_FEED 2.8,0.9; ANT_GND 6,0.9 | smd 0.5 x 0.5: FEED2 1.25,6.45 | smd 0.3 x 1.2: GND_LEFT -0.15,0.9
C0402 = smd 0.7 x 0.9: 1 -0.65,0; 2 0.65,0
0402 = smd 0.7 x 0.9: 1 -0.65,0; 2 0.65,0
C0603 = smd 1.1 x 1: 1 -0.85,0; 2 0.85,0
CC3200MOD = smd 0.8 x 0.8: P1 9.52,8.025; P2 8.25,8.025; P3 6.98,8.025; P4 5.71,8.025; P5 4.44,8.025; P6 3.17,8.025; P7 1.9,8.025; P8 0.63,8.025; P9 -0.64,8.025; P10 -1.91,8.025; P11 -3.18,8.025; P12 -4.45,8.025; P13 -5.72,8.025; P14 -6.99,8.025; P15 -8.26,8.025; P16 -9.53,8.025; P17 -9.525,6.35; P18 -9.525,5.08; P19 -9.525,3.81; P20 -9.525,2.54; P21 -9.525,1.27; P22 -9.525,0; P23 -9.525,-1.27; P24 -9.525,-2.54; P25 -9.525,-3.81; P26 -9.525,-5.08; P27 -9.525,-6.35; P28 -9.525,-8.02; P29 -8.255,-8.02; P30 -6.985,-8.02; P31 -5.715,-8.02; P32 -4.445,-8.02; P33 -3.175,-8.02; P34 -1.905,-8.02; P35 -0.635,-8.02; P36 0.635,-8.02; P37 1.905,-8.02; P38 3.175,-8.02; P39 4.445,-8.02; P40 5.715,-8.02; P41 6.985,-8.02; P42 8.255,-8.02; P43 9.525,-8.02; P44 9.525,-6.35; P45 9.525,-5.08; P46 9.525,-3.81; P47 9.525,-2.54; P48 9.525,-1.27; P49 9.525,0; P50 9.525,1.27; P51 9.525,2.54; P52 9.525,3.81; P53 9.525,5.08; P54 9.525,6.35 | smd 1.5 x 1.5: P55 4.25,4.25 | smd 2 x 2: P56 1.5,-1.5; P57 -1.5,4.5; P58 4.5,1.5; P59 1.5,1.5; P60 -1.5,1.5; P61 4.5,-1.5; P62 1.5,4.5; P63 -1.5,-1.5
SML0603 = smd 0.8 x 0.8: A 0.75,0; C -0.75,0
MA06-1 = drill 1.016 long: 1 -6.35,0; 2 -3.81,0; 3 -1.27,0; 4 1.27,0; 5 3.81,0; 6 6.35,0
JST-2-SMD = smd 1 x 4.6: 1 -1,-3.7; 2 1,-3.7 | smd 1.6 x 3.4: NC1 -3.4,1.5; NC2 3.4,1.5
1X02 = drill 1.016 pad 1.88: 1 0,0; 2 2.54,0
0805 = smd 0.8 x 1.2: 1 -0.9,0; 2 0.9,0
0603-RES = smd 1.1 x 1: 1 -0.85,0; 2 0.85,0
1X02' = drill 1.016 long: 1 -1.27,0; 2 1.27,0
SON50P300X300X100-11N = smd 0.813 x 0.305: 1 -1.473,0.991; 2 -1.473,0.508; 3 -1.473,0; 4 -1.473,-0.508; 5 -1.473,-0.991; 6 1.473,-0.991; 7 1.473,-0.508; 8 1.473,0; 9 1.473,0.508; 10 1.473,0.991 | smd 1.651 x 2.388: 11 0,0
DFN200X200X80-9N = smd 0.711 x 0.305: 1 -0.991,0.762; 2 -0.991,0.254; 3 -0.991,-0.254; 4 -0.991,-0.762; 5 0.991,-0.762; 6 0.991,-0.254; 7 0.991,0.254; 8 0.991,0.762 | smd 0.787 x 1.194: 9 0,0
LAUNCHPADXL = drill 0.914 octagon: 3.3V -22.86,8.16; 5V -20.32,8.16; GND1 -20.32,5.62; GND2 22.86,8.16; GPIO_00 -20.32,-14.7; GPIO_01 22.86,-12.16; GPIO_02 -20.32,3.08; GPIO_03 -22.86,5.62; GPIO_03_NC -20.32,-2; GPIO_04 -22.86,-4.54; GPIO_04_NC -20.32,-4.54; GPIO_05 -20.32,0.54; GPIO_05_NC 20.32,-9.62; GPIO_06 -22.86,-2; GPIO_07 -22.86,-9.62; GPIO_07_NC 20.32,-7.08; GPIO_08 -20.32,-7.08; GPIO_09 -20.32,-12.16; GPIO_09_GPIO_00_NC 20.32,0.54; GPIO_10 -22.86,-12.16; GPIO_10_NC 20.32,5.62; GPIO_11 -22.86,-14.7; GPIO_11_NC 20.32,8.16; GPIO_12_TX -22.86,0.54; GPIO_13_RX -22.86,3.08; GPIO_14_SP_CLK -22.86,-7.08; GPIO_15_MISO 22.86,-7.08; GPIO_16_MOSI 22.86,-4.54; GPIO_17_CS 22.86,3.08; GPIO_22 22.86,-14.7; GPIO_23 20.32,-12.16; GPIO_24 20.32,-14.7; GPIO_24_NC 20.32,3.08; GPIO_25 22.86,-9.62; GPIO_25_GPIO_07_NC 20.32,-2; GPIO_28 22.86,5.62; GPIO_28_NC 20.32,-4.54; GPIO_30 -20.32,-9.62; GPIO_31 22.86,0.54; RESET_OUT 22.86,-2
BMA222 = smd 0.25 x 0.3: P1 -0.75,0.775; P4 -0.75,-0.775; P5 -0.25,-0.775; P6 0.25,-0.775; P7 0.75,-0.775; P10 0.75,0.775; P11 0.25,0.775; P12 -0.25,0.775 | smd 0.3 x 0.25: P2 -0.775,0.25; P3 -0.775,-0.25; P8 0.775,-0.25; P9 0.775,0.25
QFN20-4X4 = smd 0.73 x 0.3: 1 -1.965,1; 2 -1.965,0.5; 3 -1.965,0; 4 -1.965,-0.5; 5 -1.965,-1; 11 1.965,-1; 12 1.965,-0.5; 13 1.965,0; 14 1.965,0.5; 15 1.965,1 | smd 0.3 x 0.73: 6 -1,-1.965; 7 -0.5,-1.965; 8 0,-1.965; 9 0.5,-1.965; 10 1,-1.965; 16 1,1.965; 17 0.5,1.965; 18 0,1.965; 19 -0.5,1.965; 20 -1,1.965 | smd 2.5 x 2.5: 21 0,0
ZX62R-B-5P = smd 1.35 x 0.4: 1 2.675,-1.3; 2 2.675,-0.65; 3 2.675,0; 4 2.675,0.65; 5 2.675,1.3 | smd 1.9 x 1.6: M1 0,-4.1; M2 0,4.1 | smd 2 x 2.1: M3 2.35,3.1; M4 2.35,-3.1

### Placement (x,y rotation side)
ANT_PAD  12.75,0.3 0 top
C1  14.6,7.4 0 top
C2  19.89,37.69 270 top
C3  12.93,37.29 90 top
C4  7.12,37.18 90 top
C8  39.57,32.15 0 top
C12  41.34,29.85 180 top
CC3200MOD  19.7,23.54 0 top
CHARG/LBO  31.75,34.03 270 top
DONE  33.6,34.01 270 top
FLASH  35.24,10.67 180 top
J1  47.49,36.04 0 bottom
JP2  40.39,27.39 0 top
L1  14,11.1 90 top
L2  39.49,33.89 180 top
PWR  35.4,34.05 270 top
R1  3.39,1.99 270 top
R2  5.97,2 270 top
R3  42.46,15.55 180 top
R4  4.09,37.19 270 top
R9  26.48,38.27 0 top
R10  26.5,36.09 0 top
R11  31.38,37.68 90 top
R12  33.54,37.67 90 top
R13  35.66,37.68 90 top
R14  38.79,19.52 180 top
R15  38.82,21.78 180 top
SOP2  [1X02']  37.76,15.01 0 top
THERMAL  35.54,23.1 0 top
U1  39.56,37.04 90 top
U2  22.4,37.45 270 top
U11  26.36,19.57 0 top
U$1  9.92,37.12 0 top
U$2  34.11,28.71 180 top
USB  36.52,1.51 90 bottom

### Tracks (layer width: path | path; a pad name or v marks a point on that pad's centre or on a via)
+5V_USB  (via drill 0.4, 0.6)
  Top 0.254: U$2.18 U$2.17 | U$2.19 U$2.18 | R14.2 37.19,19.52 v36.62,20.43 | v36.61,25.19 36.44,25.58 34.19,25.6 34.19,26.66 U$2.18 | 36.1,29.21 U$2.4 U$2.3 36.08,29.19 36.1,29.21 | 36.1,29.21 36.65,29.21 | 36.65,29.21 36.76,29.36 | 36.76,29.36 36.8,38.3 36.56,38.54 R13.2 | U$2.9 33.61,31.41 33.33,31.69 31.7,31.69 31.63,31.76 31.63,31.92 31.03,32.52 31.03,32.94 30.17,33.8 30.17,38.2 30.56,38.59 31.32,38.59 R11.2 | 36.65,29.21 36.72,29.21 36.73,29.22 36.73,29.33 36.76,29.36 | 36.76,29.36 36.76,31 v37.39,30.99
  Top 0.406: R11.2 R12.2 R13.2
  Route2 0.254: v37.84,5.93 37.84,18.45 37.01,18.45 36.62,18.84 v36.62,20.43
  Route15 0.254: v36.62,20.43 v36.61,25.19 37.39,25.55 v37.39,30.99
  Bottom 0.305: USB.1 35.22,5.42 35.7,5.9 37.81,5.9 v37.84,5.93
+BATT  (via drill 0.4)
  Top 0.254: 33.12,25.92 v33.11,25.85 U$2.16 | 22.65,39.43 U2.2 U2.3 | 22.65,39.43 22.9,39.66 44.66,39.66 45.11,39.13 v45.1,32.33 | C2.1 20.05,38.34 20.02,39.56 22.62,39.56 22.65,39.43
  Top 0.305: U$2.14 U$2.15 32.15,26.93 32.38,26.69 33.05,26.69 U$2.16 | v46.5,29.52 46.43,29.35 46.02,29.35 44.97,28.3 44.97,27.54 44.98,25.85 v38.07,25.85
  Bottom 0.254: v38.07,25.85 v33.11,25.85 | v45.1,32.33 J1.2
  Bottom 0.305: J1.2 v46.5,29.52
GND  (via drill 0.4, 0.4 pad 0.25)
  Top 0.254: U2.6 22.15,37.2 U2.9 | v11.36,38.82 v11.35,38.82 11.35,37.36 U$1.P9 | U$1.P1 8.74,37.89 v8.74,38.31
  Top 0.305: U1.9 39.05,37.52 39.14,37.43 39.17,37.43 U1.11 U1.3 39.56,32.92 40.41,32.93 C8.2 | U$2.11 33.11,29.71 U$2.21
  Top 0.406: C12.2 40.32,29.7
  other vias: 12.85,9.1 15.1,9.15 15.1,10.35 15.1,11.5 15.1,12.85 11.9,1.6 11.9,2.6 11.9,3.6 11.9,4.6 11.9,5.6 12.6,6.1 15.4,6.1 16.4,6.1 17.4,6.1 18.4,6.1 19.4,5.6 19.4,4.6 19.4,3.6 19.4,2.6 12.85,10.3 12.85,11.5 12.85,12.9 12.85,13.9 15.1,13.85 44.69,2.75 30.62,26.36 10.99,32.99 31.92,14.84 25.65,28.3 49.59,29.72 31.7,30.94 42.11,33.89 5.59,33.2 20.87,36.61 38.57,31.04 9.11,2.71 9.24,4.94 9.2,7.91 24.19,38.62 17.43,38.25 28.09,34.34 18.81,9.71 19.81,9.71 20.81,9.71 21.71,9.71 22.61,9.71 22.61,8.71 21.71,8.71 20.81,8.71 19.81,8.71 18.81,8.71 18.81,7.71 19.81,7.71 20.81,7.71 21.71,7.71 22.61,7.71 2.59,33.2
  pour Top (no thermals): 52.6,12.2 0.1,12.3 0.1,0.1 52.6,0.1
  pour Top: 0,12.2 52.6,12.4 52.6,41.8 -0.1,41.8
  pour Bottom (no thermals): 8.4,0.1 8.4,12.1 24.4,12 24.4,0
  pour Route2: 0.1,-0.2 52.6,-0.2 52.6,42.15 0.1,42.05
  pour Bottom: 0.1,-0.2 52.6,-0.2 52.6,44.5 0.1,44.5
  pour Route15: 0.1,-0.2 52.6,-0.2 52.6,43.6 0.1,43.6
GPIO_05  (via drill 0.4)  (1 unrouted)
  Top 0.305: v33.5,20.6 33.5,24.22 32.9,24.9 29.32,24.9 CC3200MOD.P50
  Bottom 0.305: 6.08,20.14 26.24,20.14 26.6,20.6 v33.5,20.6 33.52,20.63
GPIO_09  (via drill 0.4)
  Top 0.254: CC3200MOD.P54 28.21,29.89 v27.8,30.39 | U2.5 21.64,36.1 20.97,35.43 20.97,34.47 v20.93,34.43
  Route15 0.254: v27.8,30.39 21.3,30.39 | 21.3,30.39 v21.11,30.39 v21.1,30.39 | v21.1,30.39 9.62,30.4 8.9,29.6 8.9,16.1 7.7,14.9 7.7,7.9 7.2,7.4 6.12,7.4 6.08,7.44 6.07,7.44 U11.GPIO_09 | v21.1,30.39 21.3,30.39 | 21.3,30.39
  Bottom 0.254: v20.93,34.43 21,34.43 | 21,34.43 | 21,34.43 21,32.3 21.1,32.3 v21.1,30.39
GPIO_22  (via drill 0.4)  (1 unrouted)
  Top 0.254: v16.6,34.1 16.6,31.64 CC3200MOD.P11
  Route2 0.254: 49.26,4.9 49.9,4.9 50.8,5.8 50.8,34.8 49.7,35.9 v18.6,35.9
  Bottom 0.254: v18.6,35.9 17.6,35.9 v16.6,34.1
I2C_SCL  (via drill 0.4)
  Top 0.254: CC3200MOD.P3 26.7,31.59 v26.7,33.9 25.6,35 22.82,35 22.65,35.17 U2.7 | R2.1 7.06,2.65 7.53,3.12 7.53,5.94 7.51,5.96 5.56,5.96 4.77,6.75 4.16,6.75 U11.GPIO_10 | U$1.P12 v9.66,38.84
  Route15 0.254: 9.66,35.12 5.61,35.12 4.8,33.9 4.8,7.9 4.34,7.44 3.54,7.44 U11.GPIO_10 | 9.66,35.12 25.61,35.12 v26.7,33.9 | v9.66,38.84 9.66,35.12
I2C_SDA  (via drill 0.4)  (1 unrouted)
  Top 0.254: 3.54,4.9 2.5,4.9 1.7,5.7 1.7,33.3 v1.71,34.6 | v25.4,33.9 CC3200MOD.P4 | U2.8 23.54,36.99 v23.87,37.32 | R1.1 3.5,2.64 U11.GPIO_11 | U$1.P2 8.13,37.37 8.11,39.62 15.49,39.62 v15.51,36.79
  Bottom 0.254: v25.4,33.9 25.4,30.2 25.11,29.65 20.4,29.66 20.4,33.8 20,34.3 20,37 | v1.71,34.6 14.5,34.6 14.52,36.26 15.16,36.79 v15.51,36.79 19.16,36.79 20.02,36.14 20,37 | v23.87,37.32 20.32,37.32 20,37
JTAG_TDI  (via drill 0.4)  (1 unrouted)
  Top 0.254: v15.1,34 15.1,31.71 CC3200MOD.P12
  Route2 0.254: 46.72,7.44 47.24,7.44 48.1,8.3 48.1,34 47.3,35.08 15.06,35.17 v15.1,34
JTAG_TDO  (via drill 0.4)  (1 unrouted)
  Top 0.254: 10.05,28.5 CC3200MOD.P18 10.72,28.62 v11.4,29.3 11.44,29.26 v14.11,29.26
  Route15 0.254: v44.73,29.2 45.01,28.64 45,25 45,24.4 45.5,23.9 47.5,23.9 48.1,23.3 48.1,6.28 46.72,4.9
  Bottom 0.254: v44.73,29.2 14.14,29.19 v14.11,29.26
N$1
  cutout Top: 12.9,0.7 12.75,0.3 12.75,5.3 18.75,5.3 18.85,0.7
N$2
  Top 0.01: C1.1 14,7.4 L1.1
  Top 0.5: L1.1 ANT_PAD.FEED2
N$3
  Top 0.01: CC3200MOD.P31
  Top 0.5: CC3200MOD.P31 L1.2
N$4
  cutout Top: 13.3,16.2 13.3,5.3 14.7,5.3 14.7,16.2
N$5
  cutout Route2: 12.76,0.31 12.76,5.29 18.73,5.29 18.76,5.29 18.76,0.31
N$6
  cutout Route15: 12.76,0.31 12.76,5.31 18.76,5.31 18.76,0.31
N$7
  Top 0.254: U$1.P5 9.67,35.27 4.09,35.28 R4.2
N$8  (via drill 0.4)  (1 unrouted)
  Top 0.254: CC3200MOD.P6 22.87,32.87 v22.84,33.88
  Bottom 0.254: v22.84,33.88 22.9,35 23.4,35.4 49.8,35.4 50.8,34.65 50.8,12.7 50.5,12.4 49.38,12.4 49.26,12.52
N$10  (via drill 0.4, 0.6)
  Top 0.254: CC3200MOD.P7 v21.7,33.8 | v51.63,14.9 49.42,14.9 49.26,15.06 49.25,15.06 U11.GPIO_16_MOSI
  Route2 0.254: v42.2,36.6 50.35,36.6 51.65,35.2 51.65,30.28 v51.64,30.29
  Bottom 0.254: v21.7,33.8 21.7,35.5 22.6,36.6 v42.2,36.6 | v51.63,14.9 v51.64,30.29 v51.64,30.3 v51.65,30.3
N$11  (via drill 0.6)
  Top 0.305: v26.6,21.7 26.6,29.53 26.31,29.54 20.4,29.58 20.4,31.5 CC3200MOD.P8
  Bottom 0.254: 49.26,22.68 49.25,22.68 U11.GPIO_17_CS
  Bottom 0.305: v26.6,21.7 26.62,21.68 48.16,21.58 49.26,22.68
N$12  (via drill 0.4)  (1 unrouted)
  Top 0.254: CC3200MOD.P5 24.14,32.66 v24.1,33.9
  Route2 0.254: v24.1,33.9 24.1,29.2 23.3,28.4 9.9,28.4 9.3,27.8 9.3,14.9 8.4,13.71 5.01,13.71 3.54,12.52
N$13  (via drill 0.4)
  Top 0.305: v14.9,27.3 10.22,27.3 CC3200MOD.P19
  Bottom 0.254: 49.26,25.22 49.25,25.22 U11.GPIO_28
  Bottom 0.305: 49.26,25.22 49.26,24.96 48.2,23.9 15.3,24 14.9,24.5 v14.9,27.3
N$14  (via drill 0.4)
  Top 0.254: v28,14.3 28,15.48 CC3200MOD.P42
  Route2 0.254: v28.8,32.8 28.8,15 v28,14.3
  Route15 0.254: v7.8,32.3 28.3,32.3 v28.8,32.8
  Bottom 0.254: U11.GPIO_30 6.04,9.84 4.9,8.7 2.6,8.7 2.3,9 2.3,31.8 2.8,32.3 v7.8,32.3
N$17
  Top 0.254: R9.2 28.72,38.27 29.56,37.69 29.55,33.84 30.27,32.88 30.27,32.42 31.03,31.66 31.03,29.48 31.25,29.22 32.09,29.22 U$2.12
N$18  (via drill 0.4)
  Top 0.254: v27.8,19.6 27.8,25.8 28,26 29.15,26 CC3200MOD.P51
  Bottom 0.254: v27.8,19.6 27.1,18.88 4.28,18.88 3.54,18.24 3.54,17.6 3.53,17.6 U11.GPIO_06
N$19  (via drill 0.4)  (1 unrouted)
  Top 0.305: v32.5,16.9 32.5,23.1 32.1,23.6 29.29,23.6 CC3200MOD.P49
  Bottom 0.305: 3.54,15.06 3.56,15.06 4.8,16.5 31.4,16.5 v32.5,16.9
N$20
  Top 0.254: R10.2 28.46,36.09 29.04,35.87 29.03,33.88 29.15,33.56 29.44,33.17 29.75,32.69 29.75,32.27 30.05,31.97 30.05,28.9 30.23,28.72 U$2.13
N$21  (via drill 0.4)
  Top 0.254: v28,27.3 29.18,27.3 CC3200MOD.P52
  Route2 0.254: v28,27.3 26.8,26.1 17.5,26.1 16.6,25.2 11.6,25.2 11.1,24.7 11.1,13.6 8.5,11.1 5.01,11.1 3.98,9.98 3.54,9.98 U11.GPIO_07
N$22  (via drill 0.4)  (1 unrouted)
  Top 0.254: v28,28.5 29.11,28.5 CC3200MOD.P53
  Route2 0.254: 6.08,12.52 8.42,12.52 10,14.1 10,25.4 10.8,26.2 15.9,26.2 16.9,27.2 26.7,27.2 v28,28.5
N$24  (via drill 0.4)  (1 unrouted)
  Top 0.305: 3.54,22.68 3.58,22.68 4.7,23.8 4.7,29.9 5.6,30.8 6.4,30.8 6.7,31.1 v6.7,33.8 | v17.8,33.2 CC3200MOD.P10
  Route15 0.254: v17.8,33.2 v17.8,33.21
  Bottom 0.305: v6.7,33.8 13,33.8 13.6,33.2 v17.8,33.2
N$25  (via drill 0.4)
  Top 0.305: v15.9,21.3 15.9,29.3 16.2,29.7 18.6,29.7 19.1,30.2 19.1,31.53 CC3200MOD.P9
  Bottom 0.254: 3.54,20.14 3.53,20.14 U11.GPIO_12_TX
  Bottom 0.305: 3.54,20.14 3.84,20.14 4.9,21.33 v15.9,21.3
N$26
  Top 0.254: PWR.A 35.4,31.11 U$2.6
N$27  (via drill 0.4)  (1 unrouted)
  Top 0.305: v31.7,22.5 29.45,22.5 CC3200MOD.P48
  Bottom 0.305: 3.54,25.22 3.54,24.66 4.1,24.1 10.3,24.1 11.6,22.8 31.5,22.8 v31.7,22.5
N$28  (via drill 0.4)
  Top 0.254: THERMAL.2 36.39,24.01 v35.7,24.7 | v36,30.4 36,29.79 U$2.5
  Route15 0.254: v35.7,24.7 35.7,30.2 v36,30.4
N$29
  Top 0.305: U1.4 40.07,34.45 L2.1
N$30
  Top 0.305: U1.2 39.05,34.61 L2.2
N$31
  Top 0.254: DONE.A 34.36,33.26 34.61,33.01 U$2.7
N$32
  Top 0.254: U$2.8 34.11,32.3 32.94,32.3 32.79,32.45 32.79,33.12 32.63,33.28 CHARG/LBO.A
N$33
  Top 0.406: R11.1 31.36,35.17 CHARG/LBO.C
N$35
  Top 0.406: R12.1 33.54,34.82 DONE.C
N$36
  Top 0.406: R13.1 35.66,35.06 PWR.C
N$37  (via drill 0.4)
  Top 0.254: U$2.2 36.62,28.21 36.9,28.49 36.92,28.49 37.41,28.98 37.48,30.15 v38.79,30.17 | v38.76,22.86 37.97,22.86 R15.2
  Top 0.305: R15.2 37.97,20.99 38.34,20.62 39.47,20.62 39.81,20.28 39.81,19.69 R14.1
  Route15 0.254: v38.79,30.17 v38.76,22.86
N_RESET
  Top 0.305: CC3200MOD.P35 19.06,13.79 19.85,13.01 27.98,13.01 28.74,12.25 28.79,10.77 FLASH.6
OUT
  Top 0.305: U1.8 U1.7 U1.6 40.96,38.52 41.39,38.09 41.39,35.71 41.19,35.51 40.61,35.51 U1.5 41.77,35.57 41.87,35.47 43.3,34.96 43.3,30.1 42.05,30.1 C12.1 42.19,28.62 42.15,28.53 42.88,27.96 JP2.2
OUT_JUMP
  Top 0.305: JP2.1 36.65,27.39 U$2.1 36.08,27.05 35.83,26.81 35.18,26.81 U$2.20
RX  (via drill 0.4)
  Top 0.254: CC3200MOD.P46 29.13,19.73 v27.9,18.5 | v44.4,19.63 44.6,19.5 45.4,18.7 47.7,18.7 48.11,18.17 48.09,8.5 49.26,7.44
  Top 0.305: 49.26,7.44 49.25,7.44 U11.GPIO_01
  Route15 0.254: v27.9,18.5 29.6,18.5 31,19.63 31.01,19.62 v34.21,19.62
  Route15 0.305: 29.6,18.5 26.87,18.5 26.2,17.83 26.25,9 27.52,7.72 33.11,7.72 33.87,8.49 33.87,10.57 FLASH.4
  Bottom 0.254: v44.4,19.63 v34.22,19.63 v34.21,19.62
SOP2  (via drill 0.4)
  Top 0.305: CC3200MOD.P23 13.76,22.27 14.26,21.77 14.26,20.75 15.02,19.99 25.82,19.99 26.33,19.48 26.33,16.95 26.84,16.44 29.63,16.44 30.68,15.75 v32.03,15.76 | R3.1 44.49,15.55 v44.74,16.31 44.49,16.96 37.88,16.96 37.35,16.18 SOP2.1 36.49,11.6 FLASH.3
  Bottom 0.305: v32.03,15.76 33.68,15.75 34.45,16.18 34.45,17.45 34.96,17.96 44.11,17.96 44.49,17.58 44.49,16.56 v44.74,16.31 47.92,16.31 48.11,16.06 48.11,10.21 48.55,9.83 49.11,9.83 49.26,9.98 49.25,9.98 U11.GPIO_25
TX  (via drill 0.4, 0.6)  (1 unrouted)
  Top 0.305: 6.08,22.68 7.18,22.68 7.66,22.2 v7.66,17.58 | v31.13,17.58 31.13,20.43 30.59,20.96 29.27,20.96 CC3200MOD.P47
  Route15 0.305: v31.13,17.58 31.18,10.93 FLASH.5
  Bottom 0.305: v7.66,17.58 v31.13,17.58
VCC  (via drill 0.4)
  Top 0.254: 20.1,16.5 10.9,16.5 | CC3200MOD.P40 25.41,14.21 25.88,13.75 27.36,13.75 27.56,13.55 34.74,13.55 35.27,13.02 35.27,8.77 35.86,8.18 38.52,8.18 38.96,8.62 38.96,10.58 FLASH.2 | v37.57,32.19 37.59,32.19 | R2.2 5.36,1.34 R1.2 4.49,1.34 4.82,1.67 4.82,5.4 4.34,5.97 2.82,5.97 2.33,6.46 2.33,13.06 3,13.73 | C3.1 12.93,36.34 U$1.P7 11.51,36.34 v11.51,35.84 | U$1.P3 9.17,36.87 U$1.P4 9.16,36.33 C4.1 7.12,36.31 v5.71,36.31 5.66,36.36 5.66,38.61 5,38.97 3.04,38.97 2.5,38.63 2.5,35.89 3.5,34.89 3.5,27.8 3.53,27.77 3.53,27.76 | 3.54,27.76 3.53,27.76 | 3.53,27.76 U11.3.3V
  Top 0.305: 20.1,16.5 20.34,16.27 CC3200MOD.P36 CC3200MOD.P37 21.61,14.57 22,14.17 25.15,14.17 25.41,14.43 CC3200MOD.P40 | 10.9,16.5 10.8,16.3 9.2,16.3 8.1,15.3 8.1,13.9 7.8,13.73 3,13.73 2.31,14.27 2.32,26.69 3.54,27.76 | SOP2.2 39.05,11.84 FLASH.2 | U1.10 38.13,38.52 37.82,38.21 37.82,35.77 38.02,35.57 U1.1 38.15,35.57 37.4,35.06 37.4,32.19 v37.57,32.19 37.59,32.19 C8.1
  Route15 0.254: SOP2.2 39.03,16.16 39.83,16.96 41.41,16.96 41.68,17.23 41.68,31.82 41.23,32.27 37.65,32.27 v37.57,32.19
  Bottom 0.254: v11.51,35.84 5.71,35.84 v5.71,36.31

### Text on the board
tNames: TX | RX | SOP2 | VCC | GND | N_RESET
bNames: Breakout V3.2